# Altium project Project-C_LED.PrjPCB (part 1 of 2)
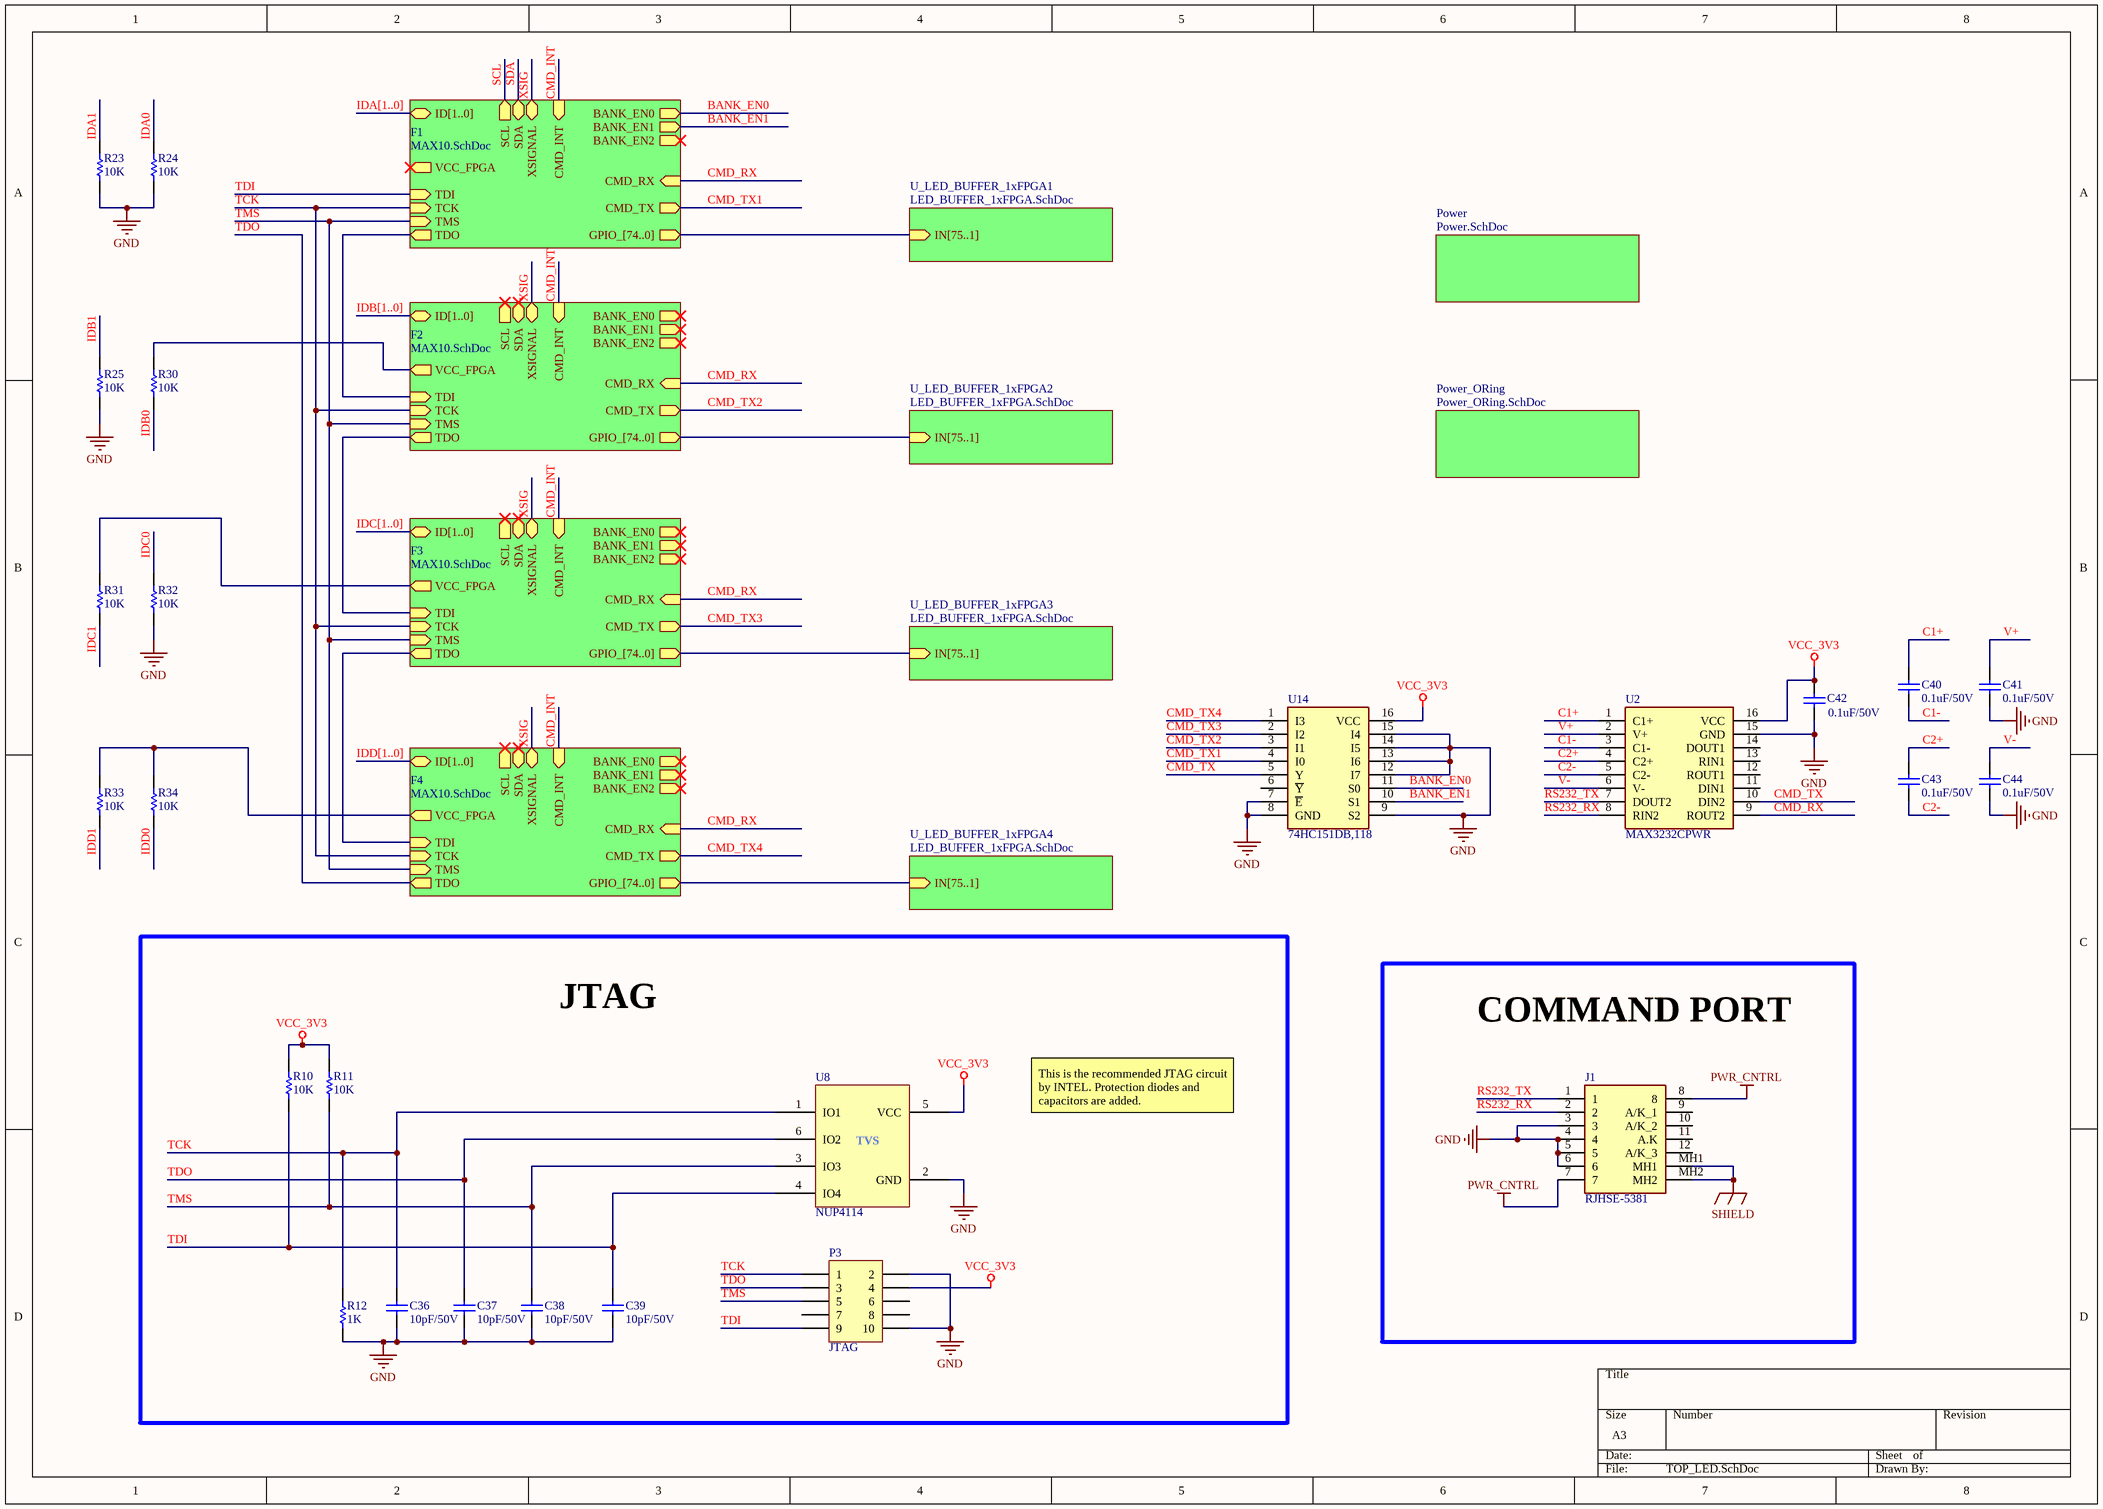
[diagram p0: TOP_LED.SchDoc]
8 sheets, 1590 parts. Net scope: hierarchical (ports join the sheet entries above them; power ports are global).
Board file: PCB5.PcbDoc
Sheets:
  TOP_LED.SchDoc
    F1 = MAX10.SchDoc
      IO = FPGA_IO.SchDoc
      POWER = FPGA_POWER.SchDoc
    Power = Power.SchDoc
    F2 = MAX10.SchDoc
      IO = FPGA_IO.SchDoc
      POWER = FPGA_POWER.SchDoc
    F3 = MAX10.SchDoc
      IO = FPGA_IO.SchDoc
      POWER = FPGA_POWER.SchDoc
    F4 = MAX10.SchDoc
      IO = FPGA_IO.SchDoc
      POWER = FPGA_POWER.SchDoc
    Power_ORing = Power_ORing.SchDoc
    U_LED_BUFFER_1xFPGA1 = LED_BUFFER_1xFPGA.SchDoc
      U_LED_BUFFER1 = LED_BUFFER.SchDoc
      U_LED_BUFFER2 = LED_BUFFER.SchDoc
      U_LED_BUFFER3 = LED_BUFFER.SchDoc
      U_LED_BUFFER4 = LED_BUFFER.SchDoc
      U_LED_BUFFER5 = LED_BUFFER.SchDoc
      U_LED_BUFFER6 = LED_BUFFER.SchDoc
      U_LED_BUFFER7 = LED_BUFFER.SchDoc
      U_LED_BUFFER8 = LED_BUFFER.SchDoc
      U_LED_BUFFER9 = LED_BUFFER.SchDoc
      U_LED_BUFFER10 = LED_BUFFER.SchDoc
    U_LED_BUFFER_1xFPGA2 = LED_BUFFER_1xFPGA.SchDoc
      U_LED_BUFFER1 = LED_BUFFER.SchDoc
      U_LED_BUFFER2 = LED_BUFFER.SchDoc
      U_LED_BUFFER3 = LED_BUFFER.SchDoc
      U_LED_BUFFER4 = LED_BUFFER.SchDoc
      U_LED_BUFFER5 = LED_BUFFER.SchDoc
      U_LED_BUFFER6 = LED_BUFFER.SchDoc
      U_LED_BUFFER7 = LED_BUFFER.SchDoc
      U_LED_BUFFER8 = LED_BUFFER.SchDoc
      U_LED_BUFFER9 = LED_BUFFER.SchDoc
      U_LED_BUFFER10 = LED_BUFFER.SchDoc
    U_LED_BUFFER_1xFPGA3 = LED_BUFFER_1xFPGA.SchDoc
      U_LED_BUFFER1 = LED_BUFFER.SchDoc
      U_LED_BUFFER2 = LED_BUFFER.SchDoc
      U_LED_BUFFER3 = LED_BUFFER.SchDoc
      U_LED_BUFFER4 = LED_BUFFER.SchDoc
      U_LED_BUFFER5 = LED_BUFFER.SchDoc
      U_LED_BUFFER6 = LED_BUFFER.SchDoc
      U_LED_BUFFER7 = LED_BUFFER.SchDoc
      U_LED_BUFFER8 = LED_BUFFER.SchDoc
      U_LED_BUFFER9 = LED_BUFFER.SchDoc
      U_LED_BUFFER10 = LED_BUFFER.SchDoc
    U_LED_BUFFER_1xFPGA4 = LED_BUFFER_1xFPGA.SchDoc
      U_LED_BUFFER1 = LED_BUFFER.SchDoc
      U_LED_BUFFER2 = LED_BUFFER.SchDoc
      U_LED_BUFFER3 = LED_BUFFER.SchDoc
      U_LED_BUFFER4 = LED_BUFFER.SchDoc
      U_LED_BUFFER5 = LED_BUFFER.SchDoc
      U_LED_BUFFER6 = LED_BUFFER.SchDoc
      U_LED_BUFFER7 = LED_BUFFER.SchDoc
      U_LED_BUFFER8 = LED_BUFFER.SchDoc
      U_LED_BUFFER9 = LED_BUFFER.SchDoc
      U_LED_BUFFER10 = LED_BUFFER.SchDoc

## Sheet TOP_LED.SchDoc
size A3

### Parts
C36  10pF/50V  [0603C]
C37  10pF/50V  [0603C]
C38  10pF/50V  [0603C]
C39  10pF/50V  [0603C]
C40  0.1uF/50V  [0603C]
C41  0.1uF/50V  [0603C]
C42  0.1uF/50V  [0603C]
C43  0.1uF/50V  [0603C]
C44  0.1uF/50V  [0603C]
J1  RJHSE-5381  [RJHSE5381]
P3  JTAG  [HDR2X5]  (no BOM)
R10  10K  [0603R]
R11  10K  [0603R]
R12  1K  [0603R]
R23  10K  [0603R]
R24  10K  [0603R]
R25  10K  [0603R]
R30  10K  [0603R]
R31  10K  [0603R]
R32  10K  [0603R]
R33  10K  [0603R]
R34  10K  [0603R]
U2  MAX3232CPWR  [MAX3232CPWR]
U8  NUP4114  [NUP4114HMR6T1G]
U14  74HC151DB,118  [74HC151DB,118]

### Blocks framed on the sheet
JTAG: C36-C39 P3 R10-R12 U8
COMMAND PORT: J1

### Sub-sheets
F1 = MAX10.SchDoc: TDI (in), TCK (in), TMS (in), TDO (out), CMD_RX (in), CMD_TX (out), SDA (bidir), CMD_INT (in), BANK_EN2 (out), GPIO_[74..0] (out), XSIGNAL (bidir), SCL (out), BANK_EN0 (out), BANK_EN1 (out), ID[1..0] (bidir), VCC_FPGA (out)
F2 = MAX10.SchDoc: TDI (in), TCK (in), TMS (in), TDO (out), CMD_RX (in), CMD_TX (out), SDA (bidir), CMD_INT (in), BANK_EN2 (out), GPIO_[74..0] (out), XSIGNAL (bidir), SCL (out), BANK_EN0 (out), BANK_EN1 (out), ID[1..0] (bidir), VCC_FPGA (out)
F3 = MAX10.SchDoc: TDI (in), TCK (in), TMS (in), TDO (out), CMD_RX (in), CMD_TX (out), SDA (bidir), CMD_INT (in), BANK_EN2 (out), GPIO_[74..0] (out), XSIGNAL (bidir), SCL (out), BANK_EN0 (out), BANK_EN1 (out), ID[1..0] (bidir), VCC_FPGA (out)
F4 = MAX10.SchDoc: TDI (in), TCK (in), TMS (in), TDO (out), CMD_RX (in), CMD_TX (out), SDA (bidir), CMD_INT (in), BANK_EN2 (out), GPIO_[74..0] (out), XSIGNAL (bidir), SCL (out), BANK_EN0 (out), BANK_EN1 (out), ID[1..0] (bidir), VCC_FPGA (out)
Power = Power.SchDoc: no entries
Power_ORing = Power_ORing.SchDoc: no entries
U_LED_BUFFER_1xFPGA1 = LED_BUFFER_1xFPGA.SchDoc: IN[75..1] (in)
U_LED_BUFFER_1xFPGA2 = LED_BUFFER_1xFPGA.SchDoc: IN[75..1] (in)
U_LED_BUFFER_1xFPGA3 = LED_BUFFER_1xFPGA.SchDoc: IN[75..1] (in)
U_LED_BUFFER_1xFPGA4 = LED_BUFFER_1xFPGA.SchDoc: IN[75..1] (in)

### Nets
GND: C36.1 C37.1 C38.1 C39.1 C41.1 C42.1 C44.1 J1.3 J1.4 J1.5 J1.6 P3.2 P3.10 R12.1 R23.2 R24.2 R25.2 R32.2 U2.15(GND) U8.2(GND) U14.7(~{E}) U14.8(GND) U14.9(S2) U14.12(I7) U14.13(I6) U14.14(I5) U14.15(I4)
PWR_CNTRL: J1.7 J1.8
SHIELD: J1.MH1 J1.MH2
VCC_3V3: C42.2 P3.4 R10.1 R11.1 U2.16(VCC) U8.5(VCC) U14.16(VCC)
BANK_EN0: U14.11(S0) ; sheet F1/BANK_EN0
BANK_EN1: U14.10(S1) ; sheet F1/BANK_EN1
C1+: C40.2 U2.1(C1+)
C1-: C40.1 U2.3(C1-)
C2+: C43.2 U2.4(C2+)
C2-: C43.1 U2.5(C2-)
CMD_INT: sheet F1/CMD_INT, sheet F2/CMD_INT, sheet F3/CMD_INT, sheet F4/CMD_INT
CMD_RX: U2.9(ROUT2) ; sheet F1/CMD_RX, sheet F2/CMD_RX, sheet F3/CMD_RX, sheet F4/CMD_RX
CMD_TX: U2.10(DIN2) U14.5(Y)
CMD_TX1: U14.4(I0) ; sheet F1/CMD_TX  [project net CMD_TX]
CMD_TX2: U14.3(I1) ; sheet F2/CMD_TX  [project net CMD_TX]
CMD_TX3: U14.2(I2) ; sheet F3/CMD_TX  [project net CMD_TX]
CMD_TX4: U14.1(I3) ; sheet F4/CMD_TX  [project net CMD_TX]
IDA0: R24.1  [project net ID0]
IDA1: R23.1  [project net ID1]
IDB0: R30.2  [project net ID0]
IDB1: R25.1  [project net ID1]
IDC0: R32.1  [project net ID0]
IDC1: R31.2  [project net ID1]
IDD0: R34.2  [project net ID0]
IDD1: R33.2  [project net ID1]
RS232_RX: J1.2 U2.8(RIN2)
RS232_TX: J1.1 U2.7(DOUT2)
TCK: C36.2 P3.1 R12.2 U8.1(IO1) ; sheet F1/TCK, sheet F2/TCK, sheet F3/TCK, sheet F4/TCK
TDI: C39.2 P3.9 R10.2 U8.4(IO4) ; sheet F1/TDI
TDI: sheet F1/TDO, sheet F2/TDI  [a separate net that carries the same name]
TDI: sheet F2/TDO, sheet F3/TDI  [a separate net that carries the same name]
TDI: sheet F3/TDO, sheet F4/TDI  [a separate net that carries the same name]
TDO: C37.2 P3.3 U8.6(IO2) ; sheet F4/TDO
TMS: C38.2 P3.5 R11.2 U8.3(IO3) ; sheet F1/TMS, sheet F2/TMS, sheet F3/TMS, sheet F4/TMS
V+: C41.2 U2.2(V+)
V-: C44.2 U2.6(V-)
VCC_FPGA: R30.1 ; sheet F2/VCC_FPGA
VCC_FPGA: R31.1 ; sheet F3/VCC_FPGA  [a separate net that carries the same name]
VCC_FPGA: R33.1 R34.1 ; sheet F4/VCC_FPGA  [a separate net that carries the same name]
XSIG: sheet F1/XSIGNAL, sheet F2/XSIGNAL, sheet F3/XSIGNAL, sheet F4/XSIGNAL

Not connected (* = marked no-connect by the designer): J1 9(A/K_1) 10(A/K_2) 11(A.K) 12(A/K_3); P3 6 7 8; U2 11(DIN1) 12(ROUT1) 13(RIN1) 14(DOUT1); U14 6(~{Y})

### Buses and harness runs
bus IDA[1..0] = sheet F1/ID[1..0]
bus IDB[1..0] = sheet F2/ID[1..0]
bus IDC[1..0] = sheet F3/ID[1..0]
bus IDD[1..0] = sheet F4/ID[1..0]
bus sheet F1/GPIO_[74..0] = sheet U_LED_BUFFER_1xFPGA1/IN[75..1]
bus sheet F2/GPIO_[74..0] = sheet U_LED_BUFFER_1xFPGA2/IN[75..1]
bus sheet F3/GPIO_[74..0] = sheet U_LED_BUFFER_1xFPGA3/IN[75..1]
bus sheet F4/GPIO_[74..0] = sheet U_LED_BUFFER_1xFPGA4/IN[75..1]

### Notes on the sheet
- This is the recommended JTAG circuit by INTEL. Protection diodes and capacitors are added.

### Library data of the parts
C36-C39 = Cap: Multilayer Ceramic Capacitors MLCC - SMD/SMT 50V 10pF 0603 C0G 5% AEC-Q200; Mfr: KEMET; Mfr Part No: C0603C100J5GACAUTO; Package: 0603; Price: 0.192; Stockiest: MOUSER; Stockiest Part No: 80-C0603C100J5GAUTO; Value: 10pF/50V
C40-C44 = Cap: Multilayer Ceramic Capacitors MLCC - SMD/SMT 50V 0.1uF 0603 X7R 20%; Mfr: KEMET; Mfr Part No: C0603C104M5RACTU; Package: 0603; Price: 0.101; Stockiest: MOUSER; Stockiest Part No: 80-C0603C104M5R; Value: 0.1uF/50V
J1 = RJHSE-5381: Modular Connectors / Ethernet Connectors R/A RJ45 SHEILDED 8 CONT Y/G LEDS; Mfr: Amphenol Commercial Products; Mfr Part No: RJHSE-5381; Price: 1.77; Stockiest: MOUSER; Stockiest Part No: 523-RJHSE-5381
P3 = Header 5X2: Header, 5-Pin, Dual row; Stockiest: MOUSER
R10 R11 R23-R25 R30-R34 = Res1: Thick Film Resistors - SMD 0603 10Kohms 1% Anti-Sulfur AEC-Q200; Mfr: ROHM Semiconductor; Mfr Part No: SFR03EZPF1002; Package: 0603; Price: 0.101; Stockiest: MOUSER; Stockiest Part No: 755-SFR03EZPF1002; Value: 10K
R12 = Res1: Resistor; Mfr: Vishay / Dale; Mfr Part No: CRCW06031K00FKEAC; Package: 0603; Price: 0.1; Stockiest: MOUSER; Stockiest Part No: 71-CRCW06031K00FKEAC; Value: 1K
U2 = MAX3232CPWR: RS-232 Interface IC 3-5.5V Mult-Ch RS232; Mfr: Texas Instruments; Mfr Part No: MAX3232CPWR; Price: 0.94; Stockiest: MOUSER; Stockiest Part No: 595-MAX3232CPWR
U8 = NUP4114: ESD Suppressors / TVS Diodes LOW CAP TVS ARRAY 5.5V; Mfr: ON SEMI; Mfr Part No: NUP4114HMR6T1G; Price: 0.534; Stockiest: MOUSER; Stockiest Part No: 863-NUP4114HMR6T1G; Value: TVS
U14 = 74HC151DB,118: Encoders, Decoders, Multiplexers & Demultiplexers 8-INPUT MULTIPLEXER; Mfr: NEXPERIA; Mfr Part No: 74HC151DB,118; Price: 0.887; Stockiest: MOUSER; Stockiest Part No: 771-HC151DB118

## Sheet MAX10.SchDoc
size B
Used 4 times, as channels F1, F2, F3, F4. Parts and nets are listed once, with the designators drawn on the sheet.
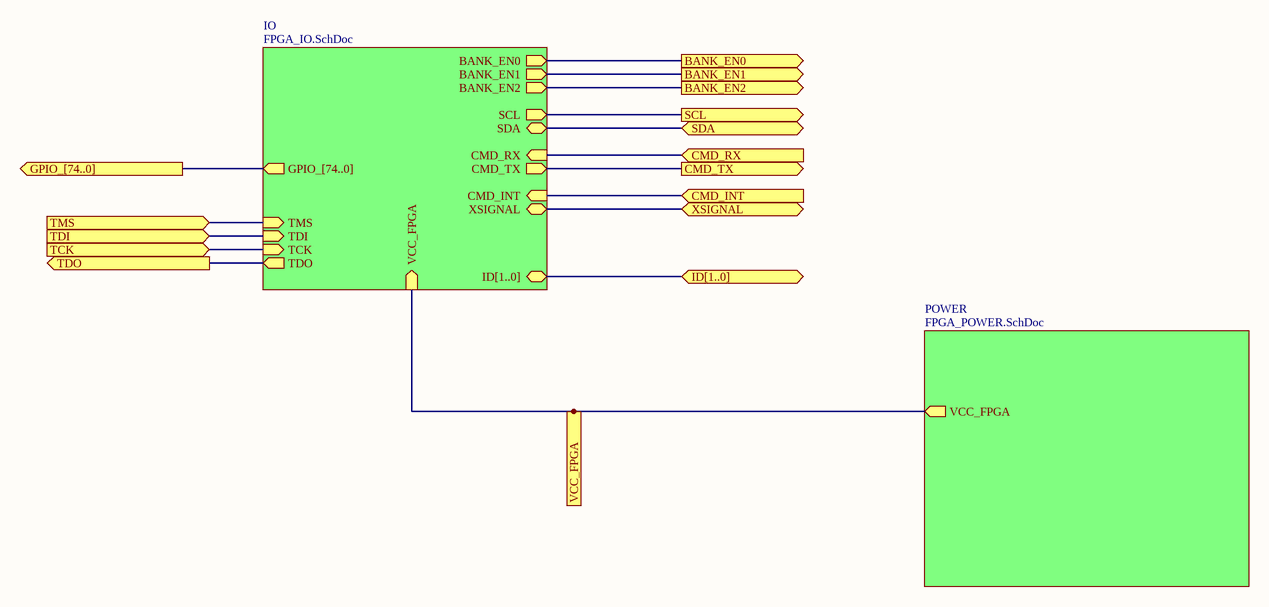
[diagram p1: MAX10.SchDoc]

### Sub-sheets
IO = FPGA_IO.SchDoc: CMD_RX (in), CMD_TX (out), BANK_EN1 (out), BANK_EN0 (out), SDA (bidir), CMD_INT (in), BANK_EN2 (out), SCL (out), GPIO_[74..0] (out), XSIGNAL (bidir), ID[1..0] (bidir), TMS (in), TDI (in), TCK (in), TDO (out), VCC_FPGA (in)
POWER = FPGA_POWER.SchDoc: VCC_FPGA (out)

### Ports
BANK_EN0 (out), BANK_EN1 (out), BANK_EN2 (out), CMD_INT (in), CMD_RX (in), CMD_TX (out), GPIO_[74..0] (out), ID[1..0] (bidir), SCL (out), SDA (bidir), TCK (in), TDI (in), TDO (out), TMS (in), VCC_FPGA (out), XSIGNAL (bidir)

### Nets
BANK_EN0: port BANK_EN0, sheet IO/BANK_EN0
BANK_EN1: port BANK_EN1, sheet IO/BANK_EN1
BANK_EN2: port BANK_EN2, sheet IO/BANK_EN2
CMD_INT: port CMD_INT, sheet IO/CMD_INT
CMD_RX: port CMD_RX, sheet IO/CMD_RX
CMD_TX: port CMD_TX, sheet IO/CMD_TX
SCL: port SCL, sheet IO/SCL
SDA: port SDA, sheet IO/SDA
TCK: port TCK, sheet IO/TCK
TDI: port TDI, sheet IO/TDI
TDO: port TDO, sheet IO/TDO
TMS: port TMS, sheet IO/TMS
VCC_FPGA: port VCC_FPGA, sheet IO/VCC_FPGA, sheet POWER/VCC_FPGA
XSIGNAL: port XSIGNAL, sheet IO/XSIGNAL

### Channels
F1: ports BANK_EN0=BANK_EN0 BANK_EN1=BANK_EN1 BANK_EN2=BANK_EN2_IO CMD_INT=CMD_INT CMD_RX=CMD_RX CMD_TX=CMD_TX SCL=SCL SDA=SDA TCK=TCK TDI=TDI TDO=TDI TMS=TMS VCC_FPGA=VCC_FPGA XSIGNAL=XSIG
F2: ports BANK_EN0=BANK_EN0_IO BANK_EN1=BANK_EN1_IO BANK_EN2=BANK_EN2_IO CMD_INT=CMD_INT CMD_RX=CMD_RX CMD_TX=CMD_TX SCL=SCL_IO SDA=SDA_IO TCK=TCK TDI=TDI TDO=TDI TMS=TMS VCC_FPGA=VCC_FPGA XSIGNAL=XSIG
F3: ports BANK_EN0=BANK_EN0_IO BANK_EN1=BANK_EN1_IO BANK_EN2=BANK_EN2_IO CMD_INT=CMD_INT CMD_RX=CMD_RX CMD_TX=CMD_TX SCL=SCL_IO SDA=SDA_IO TCK=TCK TDI=TDI TDO=TDI TMS=TMS VCC_FPGA=VCC_FPGA XSIGNAL=XSIG
F4: ports BANK_EN0=BANK_EN0_IO BANK_EN1=BANK_EN1_IO BANK_EN2=BANK_EN2_IO CMD_INT=CMD_INT CMD_RX=CMD_RX CMD_TX=CMD_TX SCL=SCL_IO SDA=SDA_IO TCK=TCK TDI=TDI TDO=TDO TMS=TMS VCC_FPGA=VCC_FPGA XSIGNAL=XSIG

### Buses and harness runs
bus port GPIO_[74..0] = sheet IO/GPIO_[74..0]
bus port ID[1..0] = sheet IO/ID[1..0]

## Sheet FPGA_IO.SchDoc
size B
Used 4 times, as channels F1/IO, F2/IO, F3/IO, F4/IO. Parts and nets are listed once, with the designators drawn on the sheet.
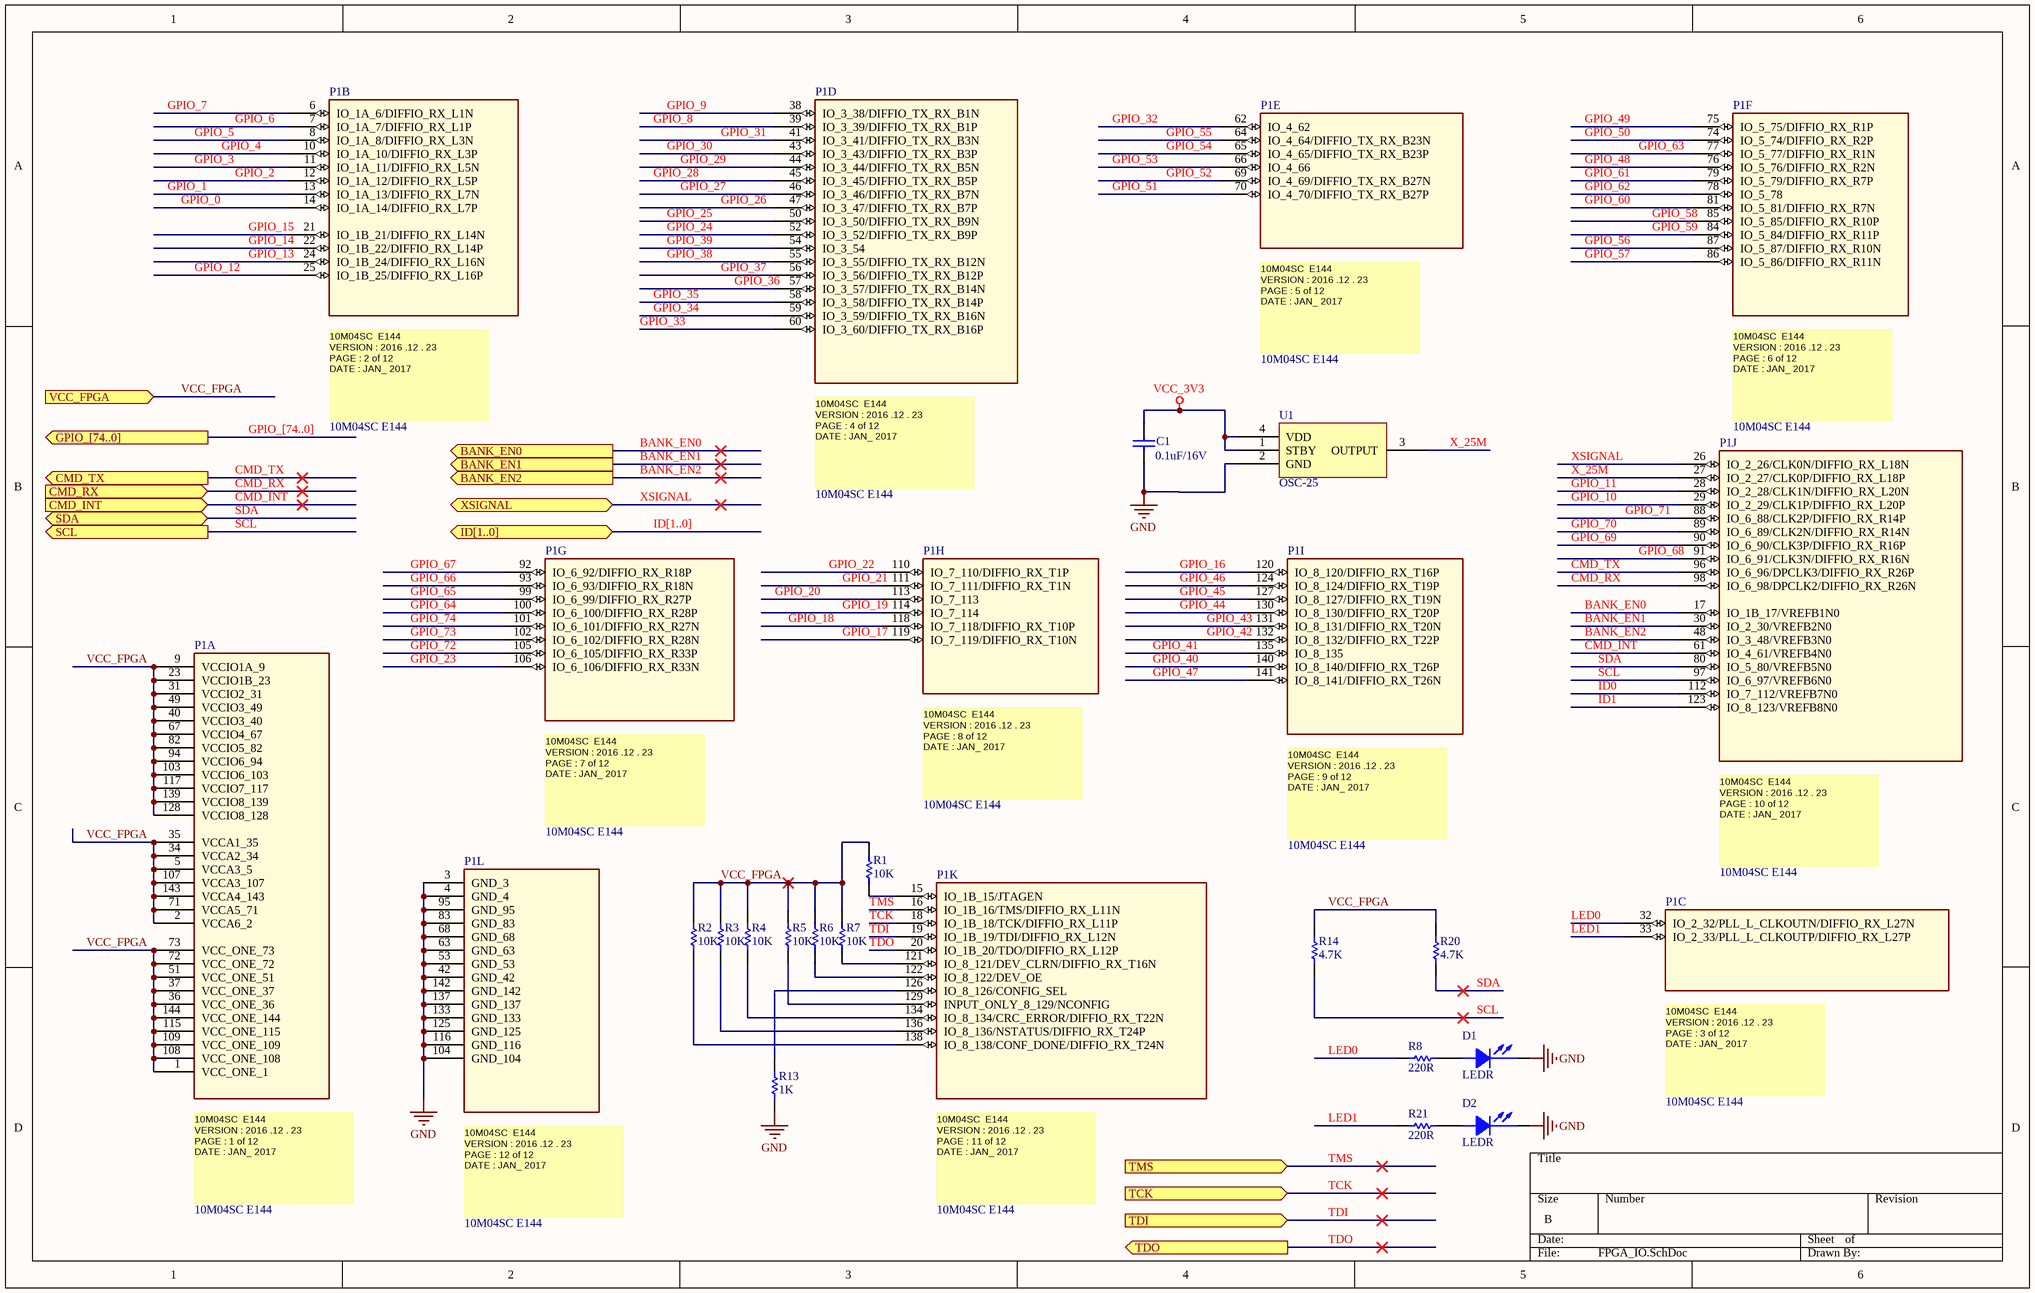
[diagram p2: FPGA_IO.SchDoc]

### Parts
C1  0.1uF/16V  [0603C]
D1  LEDR  [LED_0603]
D2  LEDR  [LED_0603]
P1  10M04SC E144  [10M04SCE144C8G]  (parts A,B,C,D,E,F,G,H,I,J,K,L of 12)
R1  10K  [0603R]
R2  10K  [0603R]
R3  10K  [0603R]
R4  10K  [0603R]
R5  10K  [0603R]
R6  10K  [0603R]
R7  10K  [0603R]
R8  220R  [0603R]
R13  1K  [0603R]
R14  4.7K  [0603R]
R20  4.7K  [0603R]
R21  220R  [0603R]
U1  OSC-25  [ASE-25.000MHZ-LC-T]

### Ports
BANK_EN0 (out), BANK_EN1 (out), BANK_EN2 (out), CMD_INT (in), CMD_RX (in), CMD_TX (out), GPIO_[74..0] (out), ID[1..0] (bidir), SCL (out), SDA (bidir), TCK (in), TDI (in), TDO (out), TMS (in), VCC_FPGA (in), XSIGNAL (bidir)

### Nets
GND: C1.1 D1.2(CATHODE) D2.2(CATHODE) P1.3(GND_3) P1.4(GND_4) P1.42(GND_42) P1.53(GND_53) P1.63(GND_63) P1.68(GND_68) P1.83(GND_83) P1.95(GND_95) P1.104(GND_104) P1.116(GND_116) P1.125(GND_125) P1.133(GND_133) P1.137(GND_137) P1.142(GND_142) R13.1 U1.2(GND)
VCC_3V3: C1.2 U1.1(STBY) U1.4(VDD)
BANK_EN0: P1.17(IO_1B_17/VREFB1N0) ; port BANK_EN0
BANK_EN1: P1.30(IO_2_30/VREFB2N0) ; port BANK_EN1
BANK_EN2: P1.48(IO_3_48/VREFB3N0) ; port BANK_EN2
CMD_INT: P1.61(IO_4_61/VREFB4N0) ; port CMD_INT
CMD_RX: P1.98(IO_6_98/DPCLK2/DIFFIO_RX_R26N) ; port CMD_RX
CMD_TX: P1.96(IO_6_96/DPCLK3/DIFFIO_RX_R26P) ; port CMD_TX
GPIO_0: P1.14(IO_1A_14/DIFFIO_RX_L7P)
GPIO_1: P1.13(IO_1A_13/DIFFIO_RX_L7N)
GPIO_2: P1.12(IO_1A_12/DIFFIO_RX_L5P)
GPIO_3: P1.11(IO_1A_11/DIFFIO_RX_L5N)
GPIO_4: P1.10(IO_1A_10/DIFFIO_RX_L3P)
GPIO_5: P1.8(IO_1A_8/DIFFIO_RX_L3N)
GPIO_6: P1.7(IO_1A_7/DIFFIO_RX_L1P)
GPIO_7: P1.6(IO_1A_6/DIFFIO_RX_L1N)
GPIO_8: P1.39(IO_3_39/DIFFIO_TX_RX_B1P)
GPIO_9: P1.38(IO_3_38/DIFFIO_TX_RX_B1N)
GPIO_10: P1.29(IO_2_29/CLK1P/DIFFIO_RX_L20P)
GPIO_11: P1.28(IO_2_28/CLK1N/DIFFIO_RX_L20N)
GPIO_12: P1.25(IO_1B_25/DIFFIO_RX_L16P)
GPIO_13: P1.24(IO_1B_24/DIFFIO_RX_L16N)
GPIO_14: P1.22(IO_1B_22/DIFFIO_RX_L14P)
GPIO_15: P1.21(IO_1B_21/DIFFIO_RX_L14N)
GPIO_16: P1.120(IO_8_120/DIFFIO_RX_T16P)
GPIO_17: P1.119(IO_7_119/DIFFIO_RX_T10N)
GPIO_18: P1.118(IO_7_118/DIFFIO_RX_T10P)
GPIO_19: P1.114(IO_7_114)
GPIO_20: P1.113(IO_7_113)
GPIO_21: P1.111(IO_7_111/DIFFIO_RX_T1N)
GPIO_22: P1.110(IO_7_110/DIFFIO_RX_T1P)
GPIO_23: P1.106(IO_6_106/DIFFIO_RX_R33N)
GPIO_24: P1.52(IO_3_52/DIFFIO_TX_RX_B9P)
GPIO_25: P1.50(IO_3_50/DIFFIO_TX_RX_B9N)
GPIO_26: P1.47(IO_3_47/DIFFIO_TX_RX_B7P)
GPIO_27: P1.46(IO_3_46/DIFFIO_TX_RX_B7N)
GPIO_28: P1.45(IO_3_45/DIFFIO_TX_RX_B5P)
GPIO_29: P1.44(IO_3_44/DIFFIO_TX_RX_B5N)
GPIO_30: P1.43(IO_3_43/DIFFIO_TX_RX_B3P)
GPIO_31: P1.41(IO_3_41/DIFFIO_TX_RX_B3N)
GPIO_32: P1.62(IO_4_62)
GPIO_33: P1.60(IO_3_60/DIFFIO_TX_RX_B16P)
GPIO_34: P1.59(IO_3_59/DIFFIO_TX_RX_B16N)
GPIO_35: P1.58(IO_3_58/DIFFIO_TX_RX_B14P)
GPIO_36: P1.57(IO_3_57/DIFFIO_TX_RX_B14N)
GPIO_37: P1.56(IO_3_56/DIFFIO_TX_RX_B12P)
GPIO_38: P1.55(IO_3_55/DIFFIO_TX_RX_B12N)
GPIO_39: P1.54(IO_3_54)
GPIO_40: P1.140(IO_8_140/DIFFIO_RX_T26P)
GPIO_41: P1.135(IO_8_135)
GPIO_42: P1.132(IO_8_132/DIFFIO_RX_T22P)
GPIO_43: P1.131(IO_8_131/DIFFIO_RX_T20N)
GPIO_44: P1.130(IO_8_130/DIFFIO_RX_T20P)
GPIO_45: P1.127(IO_8_127/DIFFIO_RX_T19N)
GPIO_46: P1.124(IO_8_124/DIFFIO_RX_T19P)
GPIO_47: P1.141(IO_8_141/DIFFIO_RX_T26N)
GPIO_48: P1.76(IO_5_76/DIFFIO_RX_R2N)
GPIO_49: P1.75(IO_5_75/DIFFIO_RX_R1P)
GPIO_50: P1.74(IO_5_74/DIFFIO_RX_R2P)
GPIO_51: P1.70(IO_4_70/DIFFIO_TX_RX_B27P)
GPIO_52: P1.69(IO_4_69/DIFFIO_TX_RX_B27N)
GPIO_53: P1.66(IO_4_66)
GPIO_54: P1.65(IO_4_65/DIFFIO_TX_RX_B23P)
GPIO_55: P1.64(IO_4_64/DIFFIO_TX_RX_B23N)
GPIO_56: P1.87(IO_5_87/DIFFIO_RX_R10N)
GPIO_57: P1.86(IO_5_86/DIFFIO_RX_R11N)
GPIO_58: P1.85(IO_5_85/DIFFIO_RX_R10P)
GPIO_59: P1.84(IO_5_84/DIFFIO_RX_R11P)
GPIO_60: P1.81(IO_5_81/DIFFIO_RX_R7N)
GPIO_61: P1.79(IO_5_79/DIFFIO_RX_R7P)
GPIO_62: P1.78(IO_5_78)
GPIO_63: P1.77(IO_5_77/DIFFIO_RX_R1N)
GPIO_64: P1.100(IO_6_100/DIFFIO_RX_R28P)
GPIO_65: P1.99(IO_6_99/DIFFIO_RX_R27P)
GPIO_66: P1.93(IO_6_93/DIFFIO_RX_R18N)
GPIO_67: P1.92(IO_6_92/DIFFIO_RX_R18P)
GPIO_68: P1.91(IO_6_91/CLK3N/DIFFIO_RX_R16N)
GPIO_69: P1.90(IO_6_90/CLK3P/DIFFIO_RX_R16P)
GPIO_70: P1.89(IO_6_89/CLK2N/DIFFIO_RX_R14N)
GPIO_71: P1.88(IO_6_88/CLK2P/DIFFIO_RX_R14P)
GPIO_72: P1.105(IO_6_105/DIFFIO_RX_R33P)
GPIO_73: P1.102(IO_6_102/DIFFIO_RX_R28N)
GPIO_74: P1.101(IO_6_101/DIFFIO_RX_R27N)
ID0: P1.112(IO_7_112/VREFB7N0)
ID1: P1.123(IO_8_123/VREFB8N0)
LED0: P1.32(IO_2_32/PLL_L_CLKOUTN/DIFFIO_RX_L27N) R8.2
LED1: P1.33(IO_2_33/PLL_L_CLKOUTP/DIFFIO_RX_L27P) R21.2
SCL: P1.97(IO_6_97/VREFB6N0) R14.1 ; port SCL
SDA: P1.80(IO_5_80/VREFB5N0) R20.1 ; port SDA
TCK: P1.18(IO_1B_18/TCK/DIFFIO_RX_L11P) ; port TCK
TDI: P1.19(IO_1B_19/TDI/DIFFIO_RX_L12N) ; port TDI
TDO: P1.20(IO_1B_20/TDO/DIFFIO_RX_L12P) ; port TDO
TMS: P1.16(IO_1B_16/TMS/DIFFIO_RX_L11N) ; port TMS
VCC_FPGA: P1.1(VCC_ONE_1) P1.2(VCCA6_2) P1.5(VCCA3_5) P1.9(VCCIO1A_9) P1.23(VCCIO1B_23) P1.31(VCCIO2_31) P1.34(VCCA2_34) P1.35(VCCA1_35) P1.36(VCC_ONE_36) P1.37(VCC_ONE_37) P1.40(VCCIO3_40) P1.49(VCCIO3_49) P1.51(VCC_ONE_51) P1.67(VCCIO4_67) P1.71(VCCA5_71) P1.72(VCC_ONE_72) P1.73(VCC_ONE_73) P1.82(VCCIO5_82) P1.94(VCCIO6_94) P1.103(VCCIO6_103) P1.107(VCCA3_107) P1.108(VCC_ONE_108) P1.109(VCC_ONE_109) P1.115(VCC_ONE_115) P1.117(VCCIO7_117) P1.128(VCCIO8_128) P1.139(VCCIO8_139) P1.143(VCCA4_143) P1.144(VCC_ONE_144) R1.1 R2.1 R3.1 R4.1 R5.1 R6.1 R7.1 R14.2 R20.2 ; port VCC_FPGA
X_25M: P1.27(IO_2_27/CLK0P/DIFFIO_RX_L18P) U1.3(OUTPUT)
XSIGNAL: P1.26(IO_2_26/CLK0N/DIFFIO_RX_L18N) ; port XSIGNAL
NetD1_1: D1.1(ANODE) R8.1
NetD2_1: D2.1(ANODE) R21.1
NetP1_15: P1.15(IO_1B_15/JTAGEN) R1.2
NetP1_121: P1.121(IO_8_121/DEV_CLRN/DIFFIO_RX_T16N) R7.2
NetP1_122: P1.122(IO_8_122/DEV_OE) R6.2
NetP1_126: P1.126(IO_8_126/CONFIG_SEL) R13.2
NetP1_129: P1.129(INPUT_ONLY_8_129/NCONFIG) R5.2
NetP1_134: P1.134(IO_8_134/CRC_ERROR/DIFFIO_RX_T22N) R4.2
NetP1_136: P1.136(IO_8_136/NSTATUS/DIFFIO_RX_T24P) R3.2
NetP1_138: P1.138(IO_8_138/CONF_DONE/DIFFIO_RX_T24N) R2.2

### Channels
F1/IO: designators end in _F1_IO; ports BANK_EN0=BANK_EN0 BANK_EN1=BANK_EN1 BANK_EN2=BANK_EN2_IO CMD_INT=CMD_INT CMD_RX=CMD_RX CMD_TX=CMD_TX SCL=SCL SDA=SDA TCK=TCK TDI=TDI TDO=TDI TMS=TMS VCC_FPGA=VCC_FPGA XSIGNAL=XSIG
F2/IO: designators end in _F2_IO; ports BANK_EN0=BANK_EN0_IO BANK_EN1=BANK_EN1_IO BANK_EN2=BANK_EN2_IO CMD_INT=CMD_INT CMD_RX=CMD_RX CMD_TX=CMD_TX SCL=SCL_IO SDA=SDA_IO TCK=TCK TDI=TDI TDO=TDI TMS=TMS VCC_FPGA=VCC_FPGA XSIGNAL=XSIG
F3/IO: designators end in _F3_IO; ports BANK_EN0=BANK_EN0_IO BANK_EN1=BANK_EN1_IO BANK_EN2=BANK_EN2_IO CMD_INT=CMD_INT CMD_RX=CMD_RX CMD_TX=CMD_TX SCL=SCL_IO SDA=SDA_IO TCK=TCK TDI=TDI TDO=TDI TMS=TMS VCC_FPGA=VCC_FPGA XSIGNAL=XSIG
F4/IO: designators end in _F4_IO; ports BANK_EN0=BANK_EN0_IO BANK_EN1=BANK_EN1_IO BANK_EN2=BANK_EN2_IO CMD_INT=CMD_INT CMD_RX=CMD_RX CMD_TX=CMD_TX SCL=SCL_IO SDA=SDA_IO TCK=TCK TDI=TDI TDO=TDO TMS=TMS VCC_FPGA=VCC_FPGA XSIGNAL=XSIG

### Buses and harness runs
bus GPIO_[74..0] = port GPIO_[74..0]
bus ID[1..0] = port ID[1..0]

### Notes on the sheet
- (in symbol 10M04SC E144, part A) 10M04SC  E144 / VERSION : 2016 .12 . 23 / PAGE : 1 of 12 / DATE : JAN_ 2017 /
- (in symbol 10M04SC E144, part B) 10M04SC  E144 / VERSION : 2016 .12 . 23 / PAGE : 2 of 12 / DATE : JAN_ 2017 /
- (in symbol 10M04SC E144, part C) 10M04SC  E144 / VERSION : 2016 .12 . 23 / PAGE : 3 of 12 / DATE : JAN_ 2017 /
- (in symbol 10M04SC E144, part D) 10M04SC  E144 / VERSION : 2016 .12 . 23 / PAGE : 4 of 12 / DATE : JAN_ 2017 /
- (in symbol 10M04SC E144, part E) 10M04SC  E144 / VERSION : 2016 .12 . 23 / PAGE : 5 of 12 / DATE : JAN_ 2017 /
- (in symbol 10M04SC E144, part F) 10M04SC  E144 / VERSION : 2016 .12 . 23 / PAGE : 6 of 12 / DATE : JAN_ 2017 /
- (in symbol 10M04SC E144, part G) 10M04SC  E144 / VERSION : 2016 .12 . 23 / PAGE : 7 of 12 / DATE : JAN_ 2017 /
- (in symbol 10M04SC E144, part H) 10M04SC  E144 / VERSION : 2016 .12 . 23 / PAGE : 8 of 12 / DATE : JAN_ 2017 /
- (in symbol 10M04SC E144, part I) 10M04SC  E144 / VERSION : 2016 .12 . 23 / PAGE : 9 of 12 / DATE : JAN_ 2017 /
- (in symbol 10M04SC E144, part J) 10M04SC  E144 / VERSION : 2016 .12 . 23 / PAGE : 10 of 12 / DATE : JAN_ 2017 /
- (in symbol 10M04SC E144, part K) 10M04SC  E144 / VERSION : 2016 .12 . 23 / PAGE : 11 of 12 / DATE : JAN_ 2017 /
- (in symbol 10M04SC E144, part L) 10M04SC  E144 / VERSION : 2016 .12 . 23 / PAGE : 12 of 12 / DATE : JAN_ 2017 /

### Library data of the parts
C1 = Cap: Multilayer Ceramic Capacitors MLCC - SMD/SMT 0603 16VDC 0.1uF 10% X7R AEC-Q200; Mfr: Taiyo Yuden; Mfr Part No: EMK107B7104KAHT; Package: 0603; Price: 0.101; Stockiest: MOUSER; Stockiest Part No: 963-EMK107B7104KAHT; Value: 0.1uF/16V
D1 D2 = LED: Standard LEDs - SMD Red 631nm 14mcd 5mA; Mfr: Lite-On; Mfr Part No: LTST-C193KRKT-5A; Package: 0603; Price: 0.393; Stockiest: MOUSER; Stockiest Part No: 859-LTSTC193KRKT5A; Value: RED
P1 = 10M04SC E144: FPGA - Field Programmable Gate Array non-volatile FPGA, 101 I/O, 144EQFP; Mfr: Intel / Altera; Mfr Part No: 10M04SCE144C8G; Package: EQFP144; Price: 11.52; Stockiest: MOUSER; Stockiest Part No: 989-10M04SCE144C8G
R1-R7 = Res1: as R10 on sheet TOP_LED; Package: 0603; Price: 0.101; Stockiest: MOUSER; Stockiest Part No: 755-SFR03EZPF1002; Value: 10K
R8 R21 = Res1: Thick Film Resistors - SMD 1/10Watt 220ohms 5% Commercial Use; Mfr: Vishay / Dale; Mfr Part No: CRCW0603220RJNEAC; Package: 0603; Price: 0.101; Stockiest: MOUSER; Stockiest Part No: 71-CRCW0603220RJNEAC; Value: 220R
R13 = Res1: as R12 on sheet TOP_LED; Package: 0603; Price: 0.1; Stockiest: MOUSER; Stockiest Part No: 71-CRCW06031K00FKEAC; Value: 1K
R14 R20 = Res1: Thick Film Resistors - SMD 1/10Watt 4.7Kohms 5% Commercial Use; Mfr: Vishay / Dale; Mfr Part No: CRCW06034K70JNEAC; Package: 0603; Price: 0.101; Stockiest: MOUSER; Stockiest Part No: 71-CRCW06034K70JNEAC; Value: 4.7K
U1 = CRYSTAL: Standard Clock Oscillators 25.0 MHZ 3.3V 50PPM SMD 32; Mfr: ABRACON; Value: 25MHZ; Mfr Part No: ASE-25.000MHZ-LC-T; Price: 1.42; Stockiest: MOUSER; Stockiest Part No: 815-ASE25.000MHZLCT

## Sheet FPGA_POWER.SchDoc
size B
Used 4 times, as channels F1/POWER, F2/POWER, F3/POWER, F4/POWER. Parts and nets are listed once, with the designators drawn on the sheet.
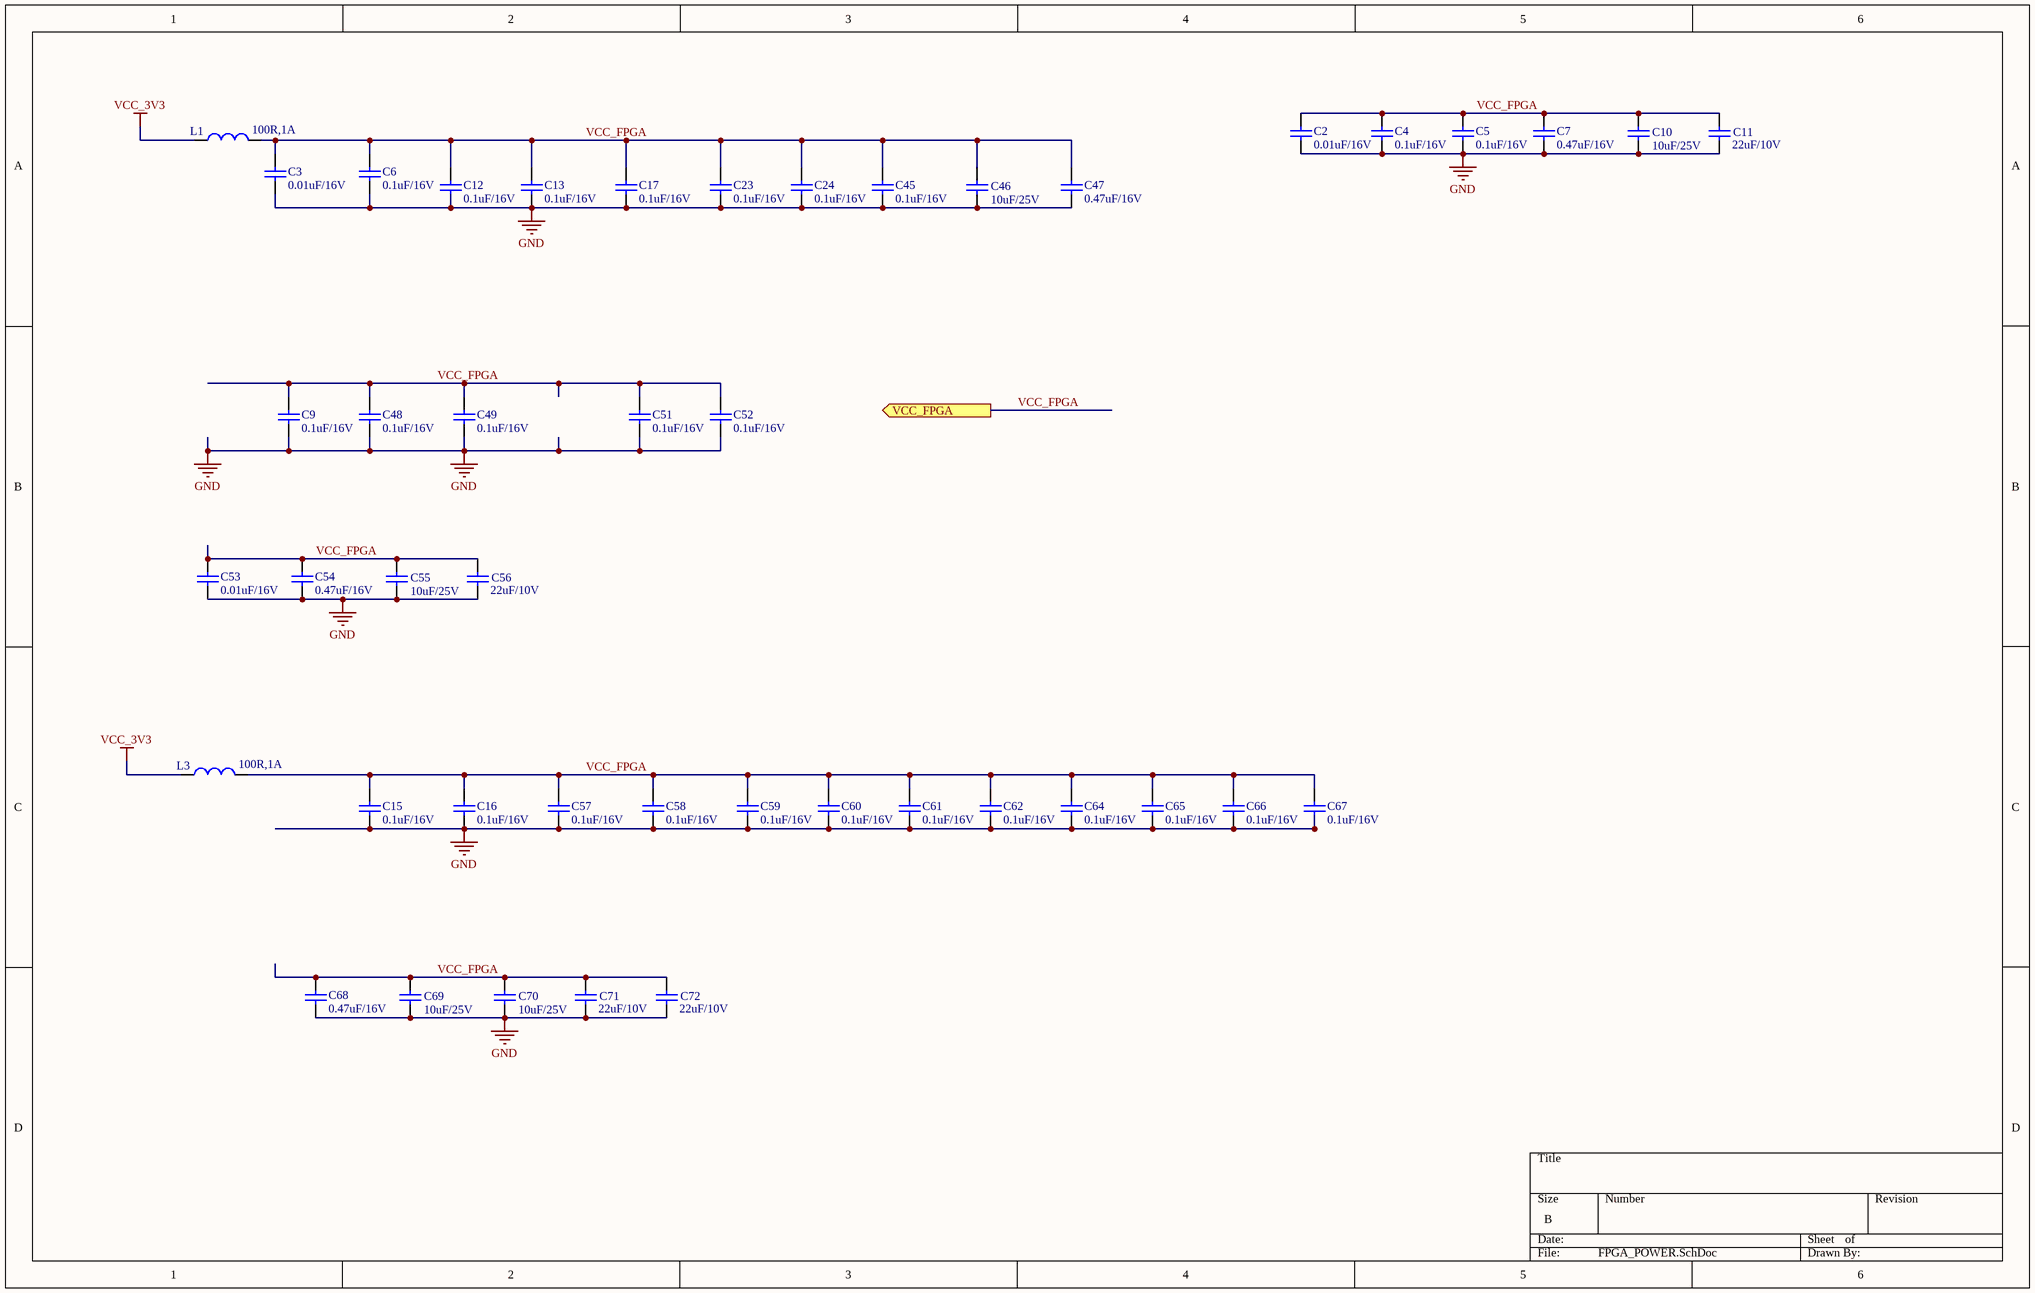
[diagram p3: FPGA_POWER.SchDoc]

### Parts
C2  0.01uF/16V  [0603C]
C3  0.01uF/16V  [0603C]
C4  0.1uF/16V  [0603C]
C5  0.1uF/16V  [0603C]
C6  0.1uF/16V  [0603C]
C7  0.47uF/16V  [0603C]
C9  0.1uF/16V  [0603C]
C10  10uF/25V  [0805C]
C11  22uF/10V  [0603C]
C12  0.1uF/16V  [0603C]
C13  0.1uF/16V  [0603C]
C15  0.1uF/16V  [0603C]
C16  0.1uF/16V  [0603C]
C17  0.1uF/16V  [0603C]
C23  0.1uF/16V  [0603C]
C24  0.1uF/16V  [0603C]
C45  0.1uF/16V  [0603C]
C46  10uF/25V  [0805C]
C47  0.47uF/16V  [0603C]
C48  0.1uF/16V  [0603C]
C49  0.1uF/16V  [0603C]
C51  0.1uF/16V  [0603C]
C52  0.1uF/16V  [0603C]
C53  0.01uF/16V  [0603C]
C54  0.47uF/16V  [0603C]
C55  10uF/25V  [0805C]
C56  22uF/10V  [0603C]
C57  0.1uF/16V  [0603C]
C58  0.1uF/16V  [0603C]
C59  0.1uF/16V  [0603C]
C60  0.1uF/16V  [0603C]
C61  0.1uF/16V  [0603C]
C62  0.1uF/16V  [0603C]
C64  0.1uF/16V  [0603C]
C65  0.1uF/16V  [0603C]
C66  0.1uF/16V  [0603C]
C67  0.1uF/16V  [0603C]
C68  0.47uF/16V  [0603C]
C69  10uF/25V  [0805C]
C70  10uF/25V  [0805C]
C71  22uF/10V  [0603C]
C72  22uF/10V  [0603C]
L1  100R,1A  [0603L]
L3  100R,1A  [0603L]

### Ports
VCC_FPGA (out)

### Nets
GND: C2.2 C3.2 C4.2 C5.2 C6.2 C7.2 C9.2 C10.1 C11.1 C12.2 C13.2 C15.2 C16.2 C17.2 C23.2 C24.2 C45.2 C46.1 C47.2 C48.2 C49.2 C51.2 C52.2 C53.2 C54.2 C55.1 C56.1 C57.2 C58.2 C59.2 C60.2 C61.2 C62.2 C64.2 C65.2 C66.2 C67.2 C68.2 C69.1 C70.1 C71.1 C72.1
VCC_3V3: L1.1 L3.1
VCC_FPGA: C2.1 C3.1 C4.1 C5.1 C6.1 C7.1 C9.1 C10.2 C11.2 C12.1 C13.1 C15.1 C16.1 C17.1 C23.1 C24.1 C45.1 C46.2 C47.1 C48.1 C49.1 C51.1 C52.1 C53.1 C54.1 C55.2 C56.2 C57.1 C58.1 C59.1 C60.1 C61.1 C62.1 C64.1 C65.1 C66.1 C67.1 C68.1 C69.2 C70.2 C71.2 C72.2 L1.2 L3.2 ; port VCC_FPGA

### Channels
F1/POWER: designators end in _F1_POWER; ports VCC_FPGA=VCC_FPGA
F2/POWER: designators end in _F2_POWER; ports VCC_FPGA=VCC_FPGA
F3/POWER: designators end in _F3_POWER; ports VCC_FPGA=VCC_FPGA
F4/POWER: designators end in _F4_POWER; ports VCC_FPGA=VCC_FPGA

### Library data of the parts
C2 C3 C53 = Cap: Multilayer Ceramic Capacitors MLCC - SMD/SMT 16V 0.01uF X7R 0603 10% AEC-Q200; Mfr: KEMET; Mfr Part No: C0603C103K4RECAUTO; Package: 0603; Price: 0.151; Stockiest: MOUSER; Stockiest Part No: 80-C0603C103K4RECAUT; Value: 0.01uF/16V
C4-C6 C9 C12 C13 C15-C17 C23 C24 C45 C48 C49 C51 C52 C57-C62 C64-C67 = Cap: as C1 on sheet FPGA_IO; Package: 0603; Price: 0.101; Stockiest: MOUSER; Stockiest Part No: 963-EMK107B7104KAHT; Value: 0.1uF/16V
C7 C47 C54 C68 = Cap: Multilayer Ceramic Capacitors MLCC - SMD/SMT 16V 0.47uF 0603 X7R 5% AEC-Q200; Mfr: KEMET; Mfr Part No: C0603C474J4RACAUTO; Package: 0603; Price: 0.444; Stockiest: MOUSER; Stockiest Part No: 80-C0603C474J4RAUTO; Value: 0.47uF/16V
C10 C46 C55 C69 C70 = Cap: Multilayer Ceramic Capacitors MLCC - SMD/SMT 0805 25VDC 10uF 20% X5R; Mfr: Taiyo Yuden; Mfr Part No: TMK212BBJ106MG-T; Package: 0805; Price: 0.232; Stockiest: MOUSER; Stockiest Part No: 963-TMK212BBJ106MG-T; Value: 10uF/25V
C11 C56 C71 C72 = Cap: Multilayer Ceramic Capacitors MLCC - SMD/SMT 1210 25VDC 22uF 20% X7R AEC-Q200; Mfr: TDK; Mfr Part No: C1608X5R1A226M080AC; Package: 0603; Price: 0.413; Stockiest: MOUSER; Stockiest Part No: 810-C1608X5R1A226M; Value: 22uF/10V
L1 L3 = 0805_IND: Ferrite Beads 100ohms 1A 60mOhms 0603 Ferrite Chip; Mfr: TDK; Mfr Part No: MPZ1608D101BTA00; Value: 100R/1A; Package: 0603; Price: 0.10; Stockiest: MOUSER; Stockiest Part No: 810-MPZ1608D101BTA00

## Sheet Power.SchDoc
size B
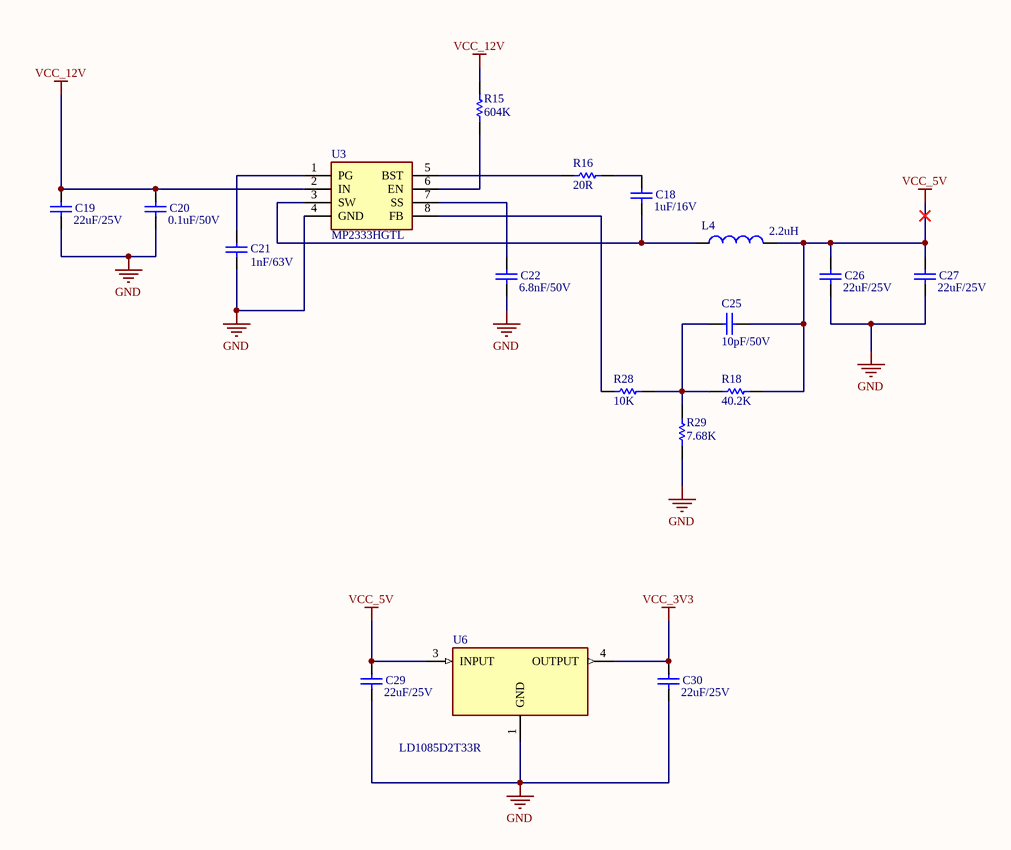
[diagram p4: Power.SchDoc]

### Parts
C18  1uF/16V  [0603C]
C19  22uF/25V  [1210C]
C20  0.1uF/50V  [0603C]
C21  1nF/63V  [0603C]
C22  6.8nF/50V  [0603C]
C25  10pF/50V  [0603C]
C26  22uF/25V  [1210C]
C27  22uF/25V  [1210C]
C29  22uF/25V  [1210C]
C30  22uF/25V  [1210C]
L4  2.2uH  [IHLP1616BZER2R2M5A]
R15  604K  [0603R]
R16  20R  [0603R]
R18  40.2K  [0603R]
R28  10K  [0603R]
R29  7.68K  [0603R]
U3  MP2333HGTL  [MP2333HGTL-P]
U6  LD1085D2T33R  [LD1085D2T33R]

### Nets
GND: C19.1 C20.1 C21.1 C22.1 C26.1 C27.1 C29.1 C30.1 R29.2 U3.4(GND) U6.1(GND)
VCC_3V3: C30.2 U6.4(OUTPUT)
VCC_5V: C25.1 C26.2 C27.2 C29.2 L4.2 R18.2 U6.3(INPUT)
VCC_12V: C19.2 C20.2 R15.2 U3.2(IN)
NetC18_1: C18.1 L4.1 U3.3(SW)
NetC18_2: C18.2 R16.2
NetC21_2: C21.2 U3.1(PG)
NetC22_2: C22.2 U3.7(SS)
NetC25_2: C25.2 R18.1 R28.1 R29.1
NetR15_1: R15.1 U3.6(EN)
NetR16_1: R16.1 U3.5(BST)
NetR28_2: R28.2 U3.8(FB)

### Library data of the parts
C18 = Cap: Multilayer Ceramic Capacitors MLCC - SMD/SMT 16volts 1uF X7R 10%; Mfr: KEMET; Mfr Part No: C0603C105K4RAC7411; Package: 0603; Price: 0.101; Stockiest: MOUSER; Stockiest Part No: 80-C0603C105K4RLR; Value: 1uF/16V
C19 C26 C27 C29 C30 = Cap: Multilayer Ceramic Capacitors MLCC - SMD/SMT 1210 25VDC 22uF 20% X7R AEC-Q200; Mfr: Taiyo Yuden; Mfr Part No: TMK325B7226MMHP; Package: 1210; Price: 0.807; Stockiest: MOUSER; Stockiest Part No: 963-TMK325B7226MMHP; Value: 22uF/25V
C20 = Cap: as C40 on sheet TOP_LED; Package: 0603; Price: 0.101; Stockiest: MOUSER; Stockiest Part No: 80-C0603C104M5R; Value: 0.1uF/50V
C21 = Cap: Multilayer Ceramic Capacitors MLCC - SMD/SMT 63V 1000pF 0603 X7R 10% AEC-Q200; Mfr: KEMET; Mfr Part No: 80-C0603C102KMREAUTO; Package: 0603; Price: 0.201; Stockiest: MOUSER; Stockiest Part No: C0603C102KMRECAUTO; Value: 1nF/63V
C22 = Cap: Multilayer Ceramic Capacitors MLCC - SMD/SMT 0603 50VDC 6.8nF 5% C0G AEC-Q200; Mfr: TDK; Mfr Part No: CGA3E2C0G1H682J080AE; Package: 0603; Price: 0.363; Stockiest: MOUSER; Stockiest Part No: 810-CGA3E2C0G1H682J8; Value: 6.8nF/50V
C25 = Cap: as C36 on sheet TOP_LED; Package: 0603; Price: 0.192; Stockiest: MOUSER; Stockiest Part No: 80-C0603C100J5GAUTO; Value: 10pF/50V
L4 = INDUCTOR: Fixed Inductors 2.2uH 20% High Temp AEC-Q200; Mfr: Vishay / Dale; Mfr Part No: IHLP1616BZER2R2M5A; Price: 1.36; Stockiest: MOUSER; Stockiest Part No: 70-IHLP1616BZR2R2M5A; Value: 2.2uH
R15 = Res1: Thick Film Resistors - SMD 0603 1% 604Kohm Anti-Sulfur AEC-Q200; Mfr: Panasonic; Mfr Part No: ERJ-U03F6043V; Package: 0603; Price: 0.221; Stockiest: MOUSER; Stockiest Part No: 667-ERJ-U03F6043V; Value: 604K
R16 = Res1: Thick Film Resistors - SMD 0603 0.25W 1% 20ohm AEC-Q200; Mfr: Panasonic; Mfr Part No: ERJ-UP3F20R0V; Package: 0603; Price: 0.262; Stockiest: MOUSER; Stockiest Part No: 667-ERJ-UP3F20R0V; Value: 20R
R18 = Res1: Thick Film Resistors - SMD 0603 Anti-Surge Res. 0.1%, 40.2Koh; Mfr: Panasonic; Mfr Part No: ERJ-PB3B4022V; Package: 0603; Price: 0.252; Stockiest: MOUSER; Stockiest Part No: 667-ERJ-PB3B4022V; Value: 40.2K
R28 = Res1: as R10 on sheet TOP_LED; Package: 0603; Price: 0.101; Stockiest: MOUSER; Stockiest Part No: 755-SFR03EZPF1002; Value: 10K
R29 = Res1: Thick Film Resistors - SMD 0603 Anti-Surge Res. 0.1%, 7.68Koh; Mfr: Panasonic; Mfr Part No: ERJ-PB3B7681V; Package: 0603; Price: 0.252; Stockiest: MOUSER; Stockiest Part No: 667-ERJ-PB3B7681V; Value: 7.68K
U3 = MP2333HGTL: Switching Voltage Regulators High-Efficiency, 3A, 18V, 1200kHz, Synchronous, Step-Down Converter; Mfr: Monolithic Power Systems (MPS); Value: 3.3V; Mfr Part No: MP2333HGTL-P; Price: 1.89; Stockiest: MOUSER; Stockiest Part No: 946-MP2333HGTL-P
U6 = LD1085D2T33R: Integrated Circuit; Mfr: STMicroelectronics; Value: 3.3V; Mfr Part No: LD1085D2T33R; Price: 1.30; Stockiest: MOUSER; Stockiest Part No: 511-LD1085D2T33-TR

## Sheet Power_ORing.SchDoc
size B
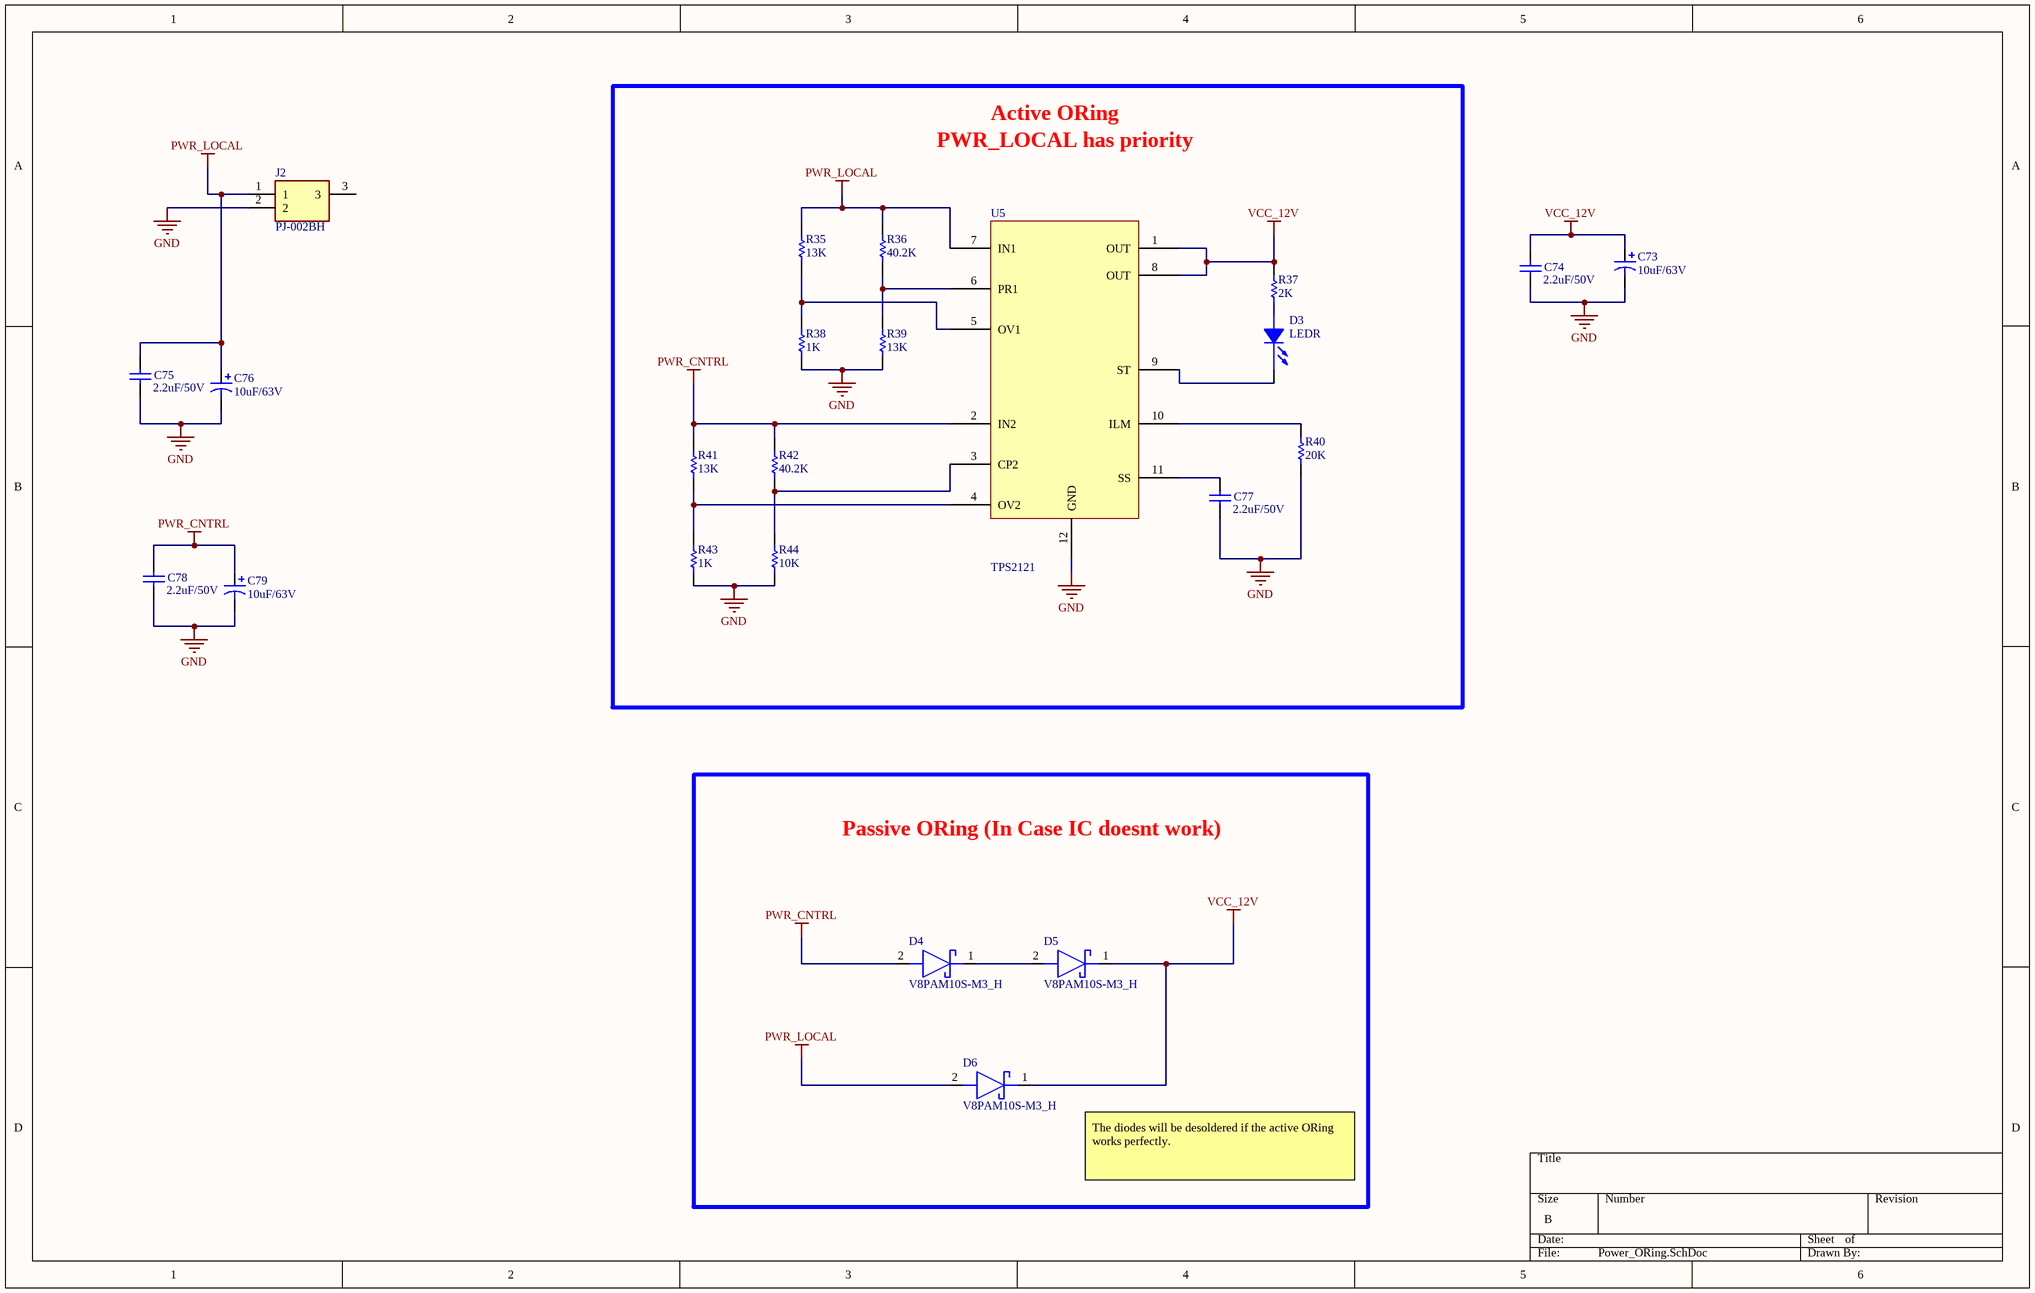
[diagram p5: Power_ORing.SchDoc]

### Parts
C73  10uF/63V  [EEE-FN1J100L]
C74  2.2uF/50V  [0603C]
C75  2.2uF/50V  [0603C]
C76  10uF/63V  [EEE-FN1J100L]
C77  2.2uF/50V  [0603C]
C78  2.2uF/50V  [0603C]
C79  10uF/63V  [EEE-FN1J100L]
D3  LEDR  [LED_0603]
D4  V8PAM10S-M3_H  [V8PAM10SHM3H]
D5  V8PAM10S-M3_H  [V8PAM10SHM3H]
D6  V8PAM10S-M3_H  [V8PAM10SHM3H]
J2  PJ-002BH  [PJ002BH]
R35  13K  [0603R]
R36  40.2K  [0603R]
R37  2K  [0603R]
R38  1K  [0603R]
R39  13K  [0603R]
R40  20K  [0603R]
R41  13K  [0603R]
R42  40.2K  [0603R]
R43  1K  [0603R]
R44  10K  [0603R]
U5  TPS2121  [TPS2121RUXT]

### Blocks framed on the sheet
Passive ORing (In Case IC doesnt work): D4-D6

### Nets
GND: C73.2 C74.1 C75.1 C76.2 C77.1 C78.1 C79.2 J2.2 R38.1 R39.2 R40.2 R43.1 R44.2 U5.12(GND)
PWR_CNTRL: C78.2 C79.1 D4.2(A) R41.1 R42.2 U5.2(IN2)
PWR_LOCAL: C75.2 C76.1 D6.2(A) J2.1 R35.1 R36.2 U5.7(IN1)
VCC_12V: C73.1 C74.2 D5.1(K) D6.1(K) R37.1 U5.1(OUT) U5.8(OUT)
NetC77_2: C77.2 U5.11(SS)
NetD3_1: D3.1(ANODE) R37.2
NetD3_2: D3.2(CATHODE) U5.9(ST)
NetD4_1: D4.1(K) D5.2(A)
NetR35_2: R35.2 R38.2 U5.5(OV1)
NetR36_1: R36.1 R39.1 U5.6(PR1)
NetR40_1: R40.1 U5.10(ILM)
NetR41_2: R41.2 R43.2 U5.4(OV2)
NetR42_1: R42.1 R44.1 U5.3(CP2)

Not connected (* = marked no-connect by the designer): J2 3

### Notes on the sheet
- PWR_LOCAL has priority
- Active ORing
- The diodes will be desoldered if the active ORing works perfectly.

### Library data of the parts
C73 C76 C79 = Cap Pol1: Polarized Capacitor (Radial); Mfr: Panasonic; Value: 10uF/63V; Mfr Part No: EEE-FN1J100L; Package: SMD; Stockiest: MOUSER; Price: 0.484; Stockiest Part No: 667-EEE-FN1J100L
C74 C75 C77 C78 = Cap: Multilayer Ceramic Capacitors MLCC - SMD/SMT 0603 2.2uF 20% 50VDC X5R; Mfr: Murata Electronics; Mfr Part No: GRM188R61H225ME11J; Package: 0603; Price: 0.333; Stockiest: MOUSER; Stockiest Part No: 81-GRM188R61H225ME1J; Value: 2.2uF/50V
D3 = LED: as D1 on sheet FPGA_IO; Package: 0603; Price: 0.393; Stockiest: MOUSER; Stockiest Part No: 859-LTSTC193KRKT5A; Value: RED
D4-D6 = V8PAM10S-M3_H: Schottky Diodes & Rectifiers 8A 100V; Mfr: Vishay General Semiconductor; Mfr Part No: V8PAM10S-M3/H; Price: 0.39; Stockiest: MOUSER; Stockiest Part No: 78-V8PAM10S-M3/H
J2 = PJ-002BH: DC Power Connectors Power Jacks; Mfr: CUI Devices; Mfr Part No: PJ-002BH; Price: 0.8; Stockiest: MOUSER; Stockiest Part No: 490-PJ-002BH
R35 R39 R41 = Res1: Thin Film Resistors - SMD 13K ohm 0.1% 25 ppm; Mfr: KOA Speer; Mfr Part No: RN73R1JTTD1302B25; Package: 0603; Price: 0.503; Stockiest: MOUSER; Stockiest Part No: 660-RN73R1JTD1302B25; Value: 13K
R36 R42 = Res1: as R18 on sheet Power; Package: 0603; Price: 0.252; Stockiest: MOUSER; Stockiest Part No: 667-ERJ-PB3B4022V; Value: 40.2K
R37 R44 = Res1: as R10 on sheet TOP_LED; Package: 0603; Price: 0.101; Stockiest: MOUSER; Stockiest Part No: 755-SFR03EZPF1002
  R37: Value: 2K
  R44: Value: 10K
R38 R43 = Res1: as R12 on sheet TOP_LED; Package: 0603; Price: 0.1; Stockiest: MOUSER; Stockiest Part No: 71-CRCW06031K00FKEAC; Value: 1K
R40 = Res1: Thick Film Resistors - SMD 20K OHM .1% 25PPM; Mfr: KOA Speer; Mfr Part No: RS73F1JTTD2002B; Package: 0603; Price: 0.61; Stockiest: MOUSER; Stockiest Part No: 660-RS73F1JTTD2002B; Value: 20K
U5 = TPS2121: Power Switch ICs - Power Distribution; Mfr: Texas Instruments; Mfr Part No: TPS2121RUXT; Price: 2.40; Stockiest: MOUSER; Stockiest Part No: 595-TPS2121RUXT

## Sheet LED_BUFFER_1xFPGA.SchDoc
size B
Used 4 times, as channels U_LED_BUFFER_1xFPGA1, U_LED_BUFFER_1xFPGA2, U_LED_BUFFER_1xFPGA3, U_LED_BUFFER_1xFPGA4. Parts and nets are listed once, with the designators drawn on the sheet.
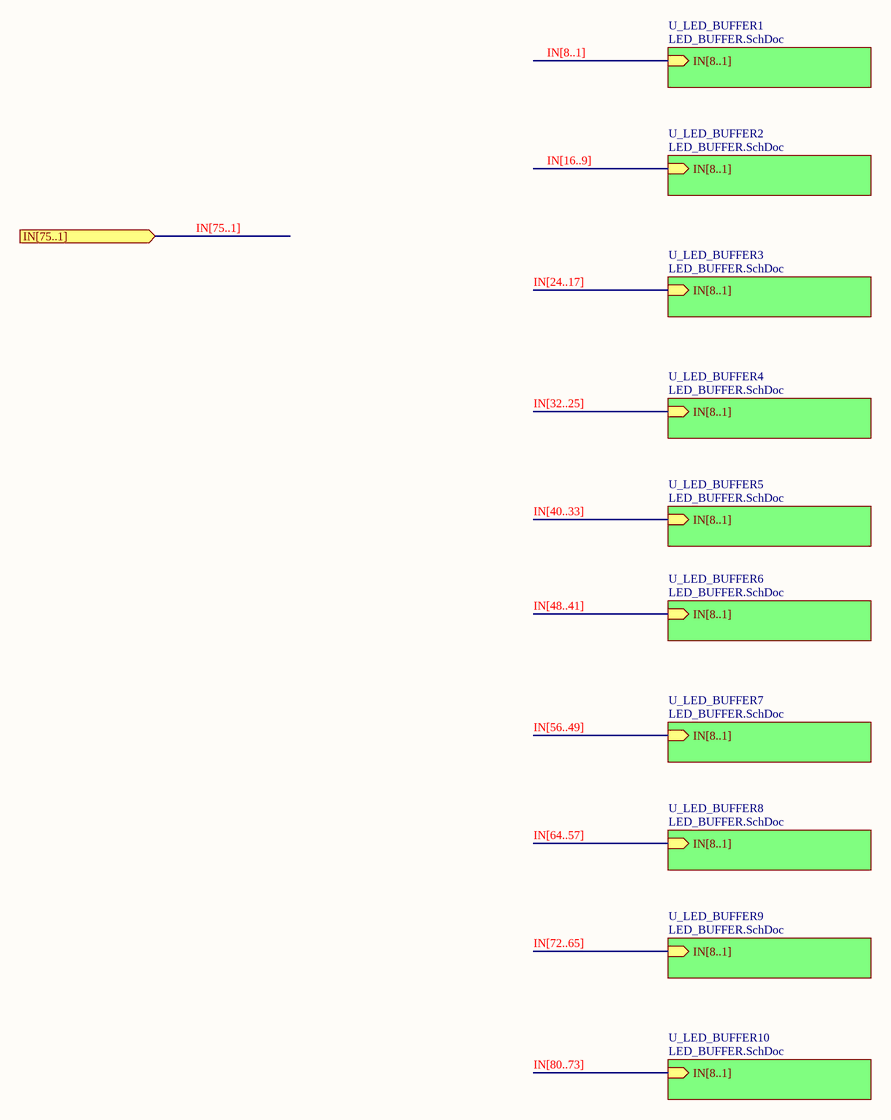
[diagram p6: LED_BUFFER_1xFPGA.SchDoc]

### Sub-sheets
U_LED_BUFFER1 = LED_BUFFER.SchDoc: IN[8..1] (in)
U_LED_BUFFER2 = LED_BUFFER.SchDoc: IN[8..1] (in)
U_LED_BUFFER3 = LED_BUFFER.SchDoc: IN[8..1] (in)
U_LED_BUFFER4 = LED_BUFFER.SchDoc: IN[8..1] (in)
U_LED_BUFFER5 = LED_BUFFER.SchDoc: IN[8..1] (in)
U_LED_BUFFER6 = LED_BUFFER.SchDoc: IN[8..1] (in)
U_LED_BUFFER7 = LED_BUFFER.SchDoc: IN[8..1] (in)
U_LED_BUFFER8 = LED_BUFFER.SchDoc: IN[8..1] (in)
U_LED_BUFFER9 = LED_BUFFER.SchDoc: IN[8..1] (in)
U_LED_BUFFER10 = LED_BUFFER.SchDoc: IN[8..1] (in)

### Ports
IN[75..1] (in)

### Channels
U_LED_BUFFER_1xFPGA1: no parts or ports
U_LED_BUFFER_1xFPGA2: no parts or ports
U_LED_BUFFER_1xFPGA3: no parts or ports
U_LED_BUFFER_1xFPGA4: no parts or ports

### Buses and harness runs
bus IN[8..1] = sheet U_LED_BUFFER1/IN[8..1]
bus IN[16..9] = sheet U_LED_BUFFER2/IN[8..1]
bus IN[24..17] = sheet U_LED_BUFFER3/IN[8..1]
bus IN[32..25] = sheet U_LED_BUFFER4/IN[8..1]
bus IN[40..33] = sheet U_LED_BUFFER5/IN[8..1]
bus IN[48..41] = sheet U_LED_BUFFER6/IN[8..1]
bus IN[56..49] = sheet U_LED_BUFFER7/IN[8..1]
bus IN[64..57] = sheet U_LED_BUFFER8/IN[8..1]
bus IN[72..65] = sheet U_LED_BUFFER9/IN[8..1]
bus IN[75..1] = port IN[75..1]
bus IN[80..73] = sheet U_LED_BUFFER10/IN[8..1]

## Sheet LED_BUFFER.SchDoc
size B
Used 40 times, as channels U_LED_BUFFER_1xFPGA1/U_LED_BUFFER1, U_LED_BUFFER_1xFPGA1/U_LED_BUFFER2, U_LED_BUFFER_1xFPGA1/U_LED_BUFFER3, U_LED_BUFFER_1xFPGA1/U_LED_BUFFER4, U_LED_BUFFER_1xFPGA1/U_LED_BUFFER5, U_LED_BUFFER_1xFPGA1/U_LED_BUFFER6, U_LED_BUFFER_1xFPGA1/U_LED_BUFFER7, U_LED_BUFFER_1xFPGA1/U_LED_BUFFER8, U_LED_BUFFER_1xFPGA1/U_LED_BUFFER9, U_LED_BUFFER_1xFPGA1/U_LED_BUFFER10, U_LED_BUFFER_1xFPGA2/U_LED_BUFFER1, U_LED_BUFFER_1xFPGA2/U_LED_BUFFER2, U_LED_BUFFER_1xFPGA2/U_LED_BUFFER3, U_LED_BUFFER_1xFPGA2/U_LED_BUFFER4, U_LED_BUFFER_1xFPGA2/U_LED_BUFFER5, U_LED_BUFFER_1xFPGA2/U_LED_BUFFER6, U_LED_BUFFER_1xFPGA2/U_LED_BUFFER7, U_LED_BUFFER_1xFPGA2/U_LED_BUFFER8, U_LED_BUFFER_1xFPGA2/U_LED_BUFFER9, U_LED_BUFFER_1xFPGA2/U_LED_BUFFER10, U_LED_BUFFER_1xFPGA3/U_LED_BUFFER1, U_LED_BUFFER_1xFPGA3/U_LED_BUFFER2, U_LED_BUFFER_1xFPGA3/U_LED_BUFFER3, U_LED_BUFFER_1xFPGA3/U_LED_BUFFER4, U_LED_BUFFER_1xFPGA3/U_LED_BUFFER5, U_LED_BUFFER_1xFPGA3/U_LED_BUFFER6, U_LED_BUFFER_1xFPGA3/U_LED_BUFFER7, U_LED_BUFFER_1xFPGA3/U_LED_BUFFER8, U_LED_BUFFER_1xFPGA3/U_LED_BUFFER9, U_LED_BUFFER_1xFPGA3/U_LED_BUFFER10, U_LED_BUFFER_1xFPGA4/U_LED_BUFFER1, U_LED_BUFFER_1xFPGA4/U_LED_BUFFER2, U_LED_BUFFER_1xFPGA4/U_LED_BUFFER3, U_LED_BUFFER_1xFPGA4/U_LED_BUFFER4, U_LED_BUFFER_1xFPGA4/U_LED_BUFFER5, U_LED_BUFFER_1xFPGA4/U_LED_BUFFER6, U_LED_BUFFER_1xFPGA4/U_LED_BUFFER7, U_LED_BUFFER_1xFPGA4/U_LED_BUFFER8, U_LED_BUFFER_1xFPGA4/U_LED_BUFFER9, U_LED_BUFFER_1xFPGA4/U_LED_BUFFER10. Parts and nets are listed once, with the designators drawn on the sheet.
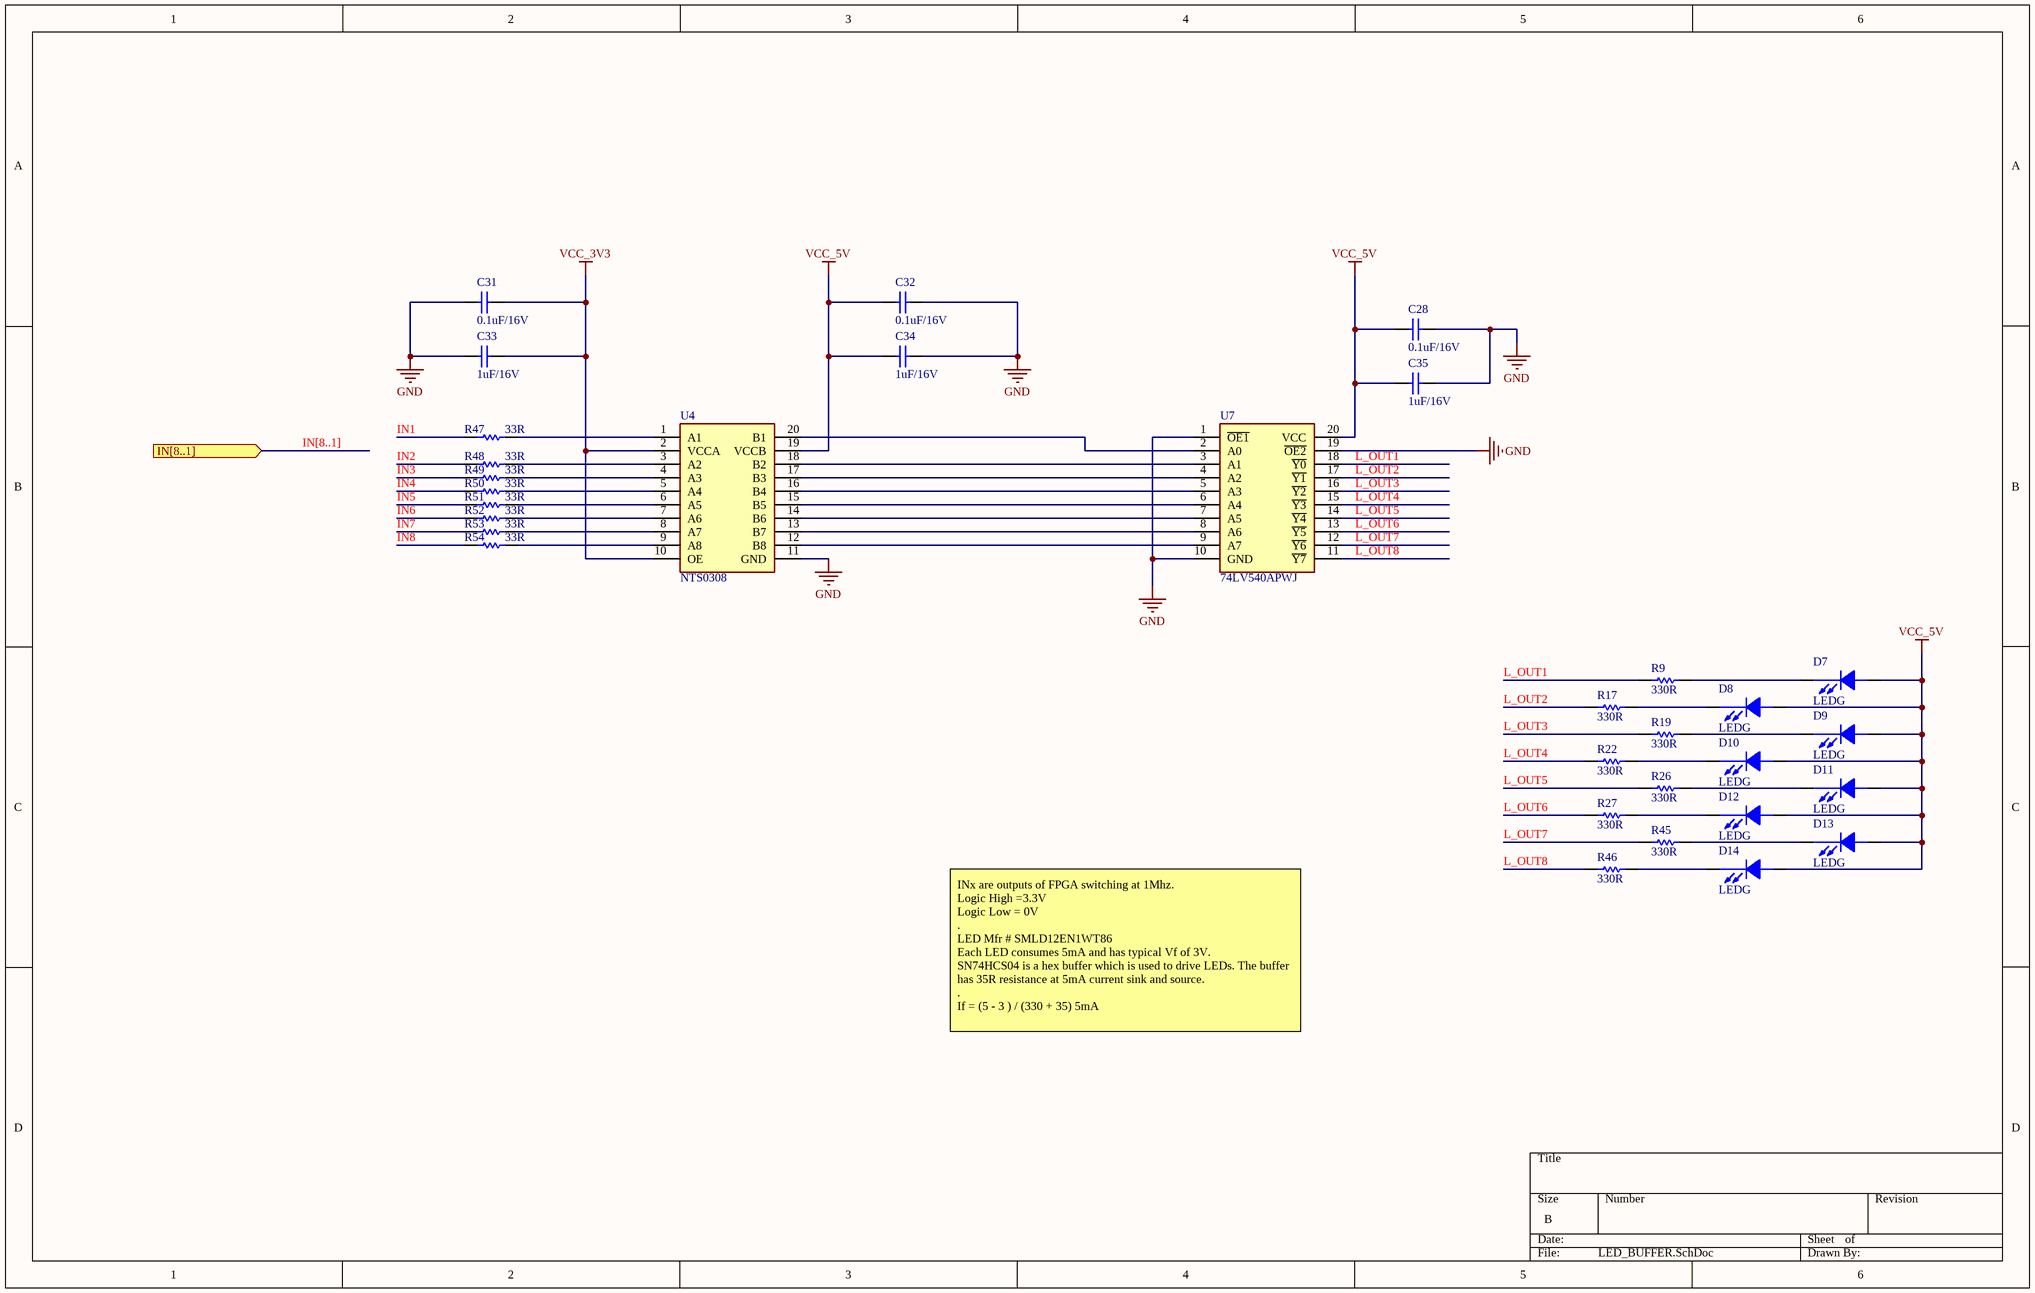
[diagram p7: LED_BUFFER.SchDoc]

### Parts
C28  0.1uF/16V  [0603C]
C31  0.1uF/16V  [0603C]
C32  0.1uF/16V  [0603C]
C33  1uF/16V  [0603C]
C34  1uF/16V  [0603C]
C35  1uF/16V  [0603C]
D7  LEDG  [LED_0603]
D8  LEDG  [LED_0603]
D9  LEDG  [LED_0603]
D10  LEDG  [LED_0603]
D11  LEDG  [LED_0603]
D12  LEDG  [LED_0603]
D13  LEDG  [LED_0603]
D14  LEDG  [LED_0603]
R9  330R  [0603R]
R17  330R  [0603R]
R19  330R  [0603R]
R22  330R  [0603R]
R26  330R  [0603R]
R27  330R  [0603R]
R45  330R  [0603R]
R46  330R  [0603R]
R47  33R  [0603R]
R48  33R  [0603R]
R49  33R  [0603R]
R50  33R  [0603R]
R51  33R  [0603R]
R52  33R  [0603R]
R53  33R  [0603R]
R54  33R  [0603R]
U4  NTS0308  [NTS0308EPWJ]
U7  74LV540APWJ  [SOP65P640X110-20N]

### Ports
IN[8..1] (in)

### Nets
GND: C28.2 C31.1 C32.2 C33.1 C34.2 C35.2 U4.11(GND) U7.1(~{OE1}) U7.10(GND) U7.19(~{OE2})
VCC_3V3: C31.2 C33.2 U4.2(VCCA) U4.10(OE)
VCC_5V: C28.1 C32.1 C34.1 C35.1 D7.1(ANODE) D8.1(ANODE) D9.1(ANODE) D10.1(ANODE) D11.1(ANODE) D12.1(ANODE) D13.1(ANODE) D14.1(ANODE) U4.19(VCCB) U7.20(VCC)
IN1: R47.2
IN2: R48.2
IN3: R49.2
IN4: R50.2
IN5: R51.2
IN6: R52.2
IN7: R53.2
IN8: R54.2
L_OUT1: R9.2 U7.18(~{Y0})
L_OUT2: R17.2 U7.17(~{Y1})
L_OUT3: R19.2 U7.16(~{Y2})
L_OUT4: R22.2 U7.15(~{Y3})
L_OUT5: R26.2 U7.14(~{Y4})
L_OUT6: R27.2 U7.13(~{Y5})
L_OUT7: R45.2 U7.12(~{Y6})
L_OUT8: R46.2 U7.11(~{Y7})
NetD7_2: D7.2(CATHODE) R9.1
NetD8_2: D8.2(CATHODE) R17.1
NetD9_2: D9.2(CATHODE) R19.1
NetD10_2: D10.2(CATHODE) R22.1
NetD11_2: D11.2(CATHODE) R26.1
NetD12_2: D12.2(CATHODE) R27.1
NetD13_2: D13.2(CATHODE) R45.1
NetD14_2: D14.2(CATHODE) R46.1
NetR47_1: R47.1 U4.1(A1)
NetR48_1: R48.1 U4.3(A2)
NetR49_1: R49.1 U4.4(A3)
NetR50_1: R50.1 U4.5(A4)
NetR51_1: R51.1 U4.6(A5)
NetR52_1: R52.1 U4.7(A6)
NetR53_1: R53.1 U4.8(A7)
NetR54_1: R54.1 U4.9(A8)
NetU4_12: U4.12(B8) U7.9(A7)
NetU4_13: U4.13(B7) U7.8(A6)
NetU4_14: U4.14(B6) U7.7(A5)
NetU4_15: U4.15(B5) U7.6(A4)
NetU4_16: U4.16(B4) U7.5(A3)
NetU4_17: U4.17(B3) U7.4(A2)
NetU4_18: U4.18(B2) U7.3(A1)
NetU4_20: U4.20(B1) U7.2(A0)

### Channels
U_LED_BUFFER_1xFPGA1/U_LED_BUFFER1: designators end in _U_LED_BUFFER_1xFPGA1_U_LED_BUFFER1
U_LED_BUFFER_1xFPGA1/U_LED_BUFFER2: designators end in _U_LED_BUFFER_1xFPGA1_U_LED_BUFFER2
U_LED_BUFFER_1xFPGA1/U_LED_BUFFER3: designators end in _U_LED_BUFFER_1xFPGA1_U_LED_BUFFER3
U_LED_BUFFER_1xFPGA1/U_LED_BUFFER4: designators end in _U_LED_BUFFER_1xFPGA1_U_LED_BUFFER4
U_LED_BUFFER_1xFPGA1/U_LED_BUFFER5: designators end in _U_LED_BUFFER_1xFPGA1_U_LED_BUFFER5
U_LED_BUFFER_1xFPGA1/U_LED_BUFFER6: designators end in _U_LED_BUFFER_1xFPGA1_U_LED_BUFFER6
U_LED_BUFFER_1xFPGA1/U_LED_BUFFER7: designators end in _U_LED_BUFFER_1xFPGA1_U_LED_BUFFER7
U_LED_BUFFER_1xFPGA1/U_LED_BUFFER8: designators end in _U_LED_BUFFER_1xFPGA1_U_LED_BUFFER8
U_LED_BUFFER_1xFPGA1/U_LED_BUFFER9: designators end in _U_LED_BUFFER_1xFPGA1_U_LED_BUFFER9
U_LED_BUFFER_1xFPGA1/U_LED_BUFFER10: designators end in _U_LED_BUFFER_1xFPGA1_U_LED_BUFFER10
U_LED_BUFFER_1xFPGA2/U_LED_BUFFER1: designators end in _U_LED_BUFFER_1xFPGA2_U_LED_BUFFER1
U_LED_BUFFER_1xFPGA2/U_LED_BUFFER2: designators end in _U_LED_BUFFER_1xFPGA2_U_LED_BUFFER2
U_LED_BUFFER_1xFPGA2/U_LED_BUFFER3: designators end in _U_LED_BUFFER_1xFPGA2_U_LED_BUFFER3
U_LED_BUFFER_1xFPGA2/U_LED_BUFFER4: designators end in _U_LED_BUFFER_1xFPGA2_U_LED_BUFFER4
U_LED_BUFFER_1xFPGA2/U_LED_BUFFER5: designators end in _U_LED_BUFFER_1xFPGA2_U_LED_BUFFER5
U_LED_BUFFER_1xFPGA2/U_LED_BUFFER6: designators end in _U_LED_BUFFER_1xFPGA2_U_LED_BUFFER6
U_LED_BUFFER_1xFPGA2/U_LED_BUFFER7: designators end in _U_LED_BUFFER_1xFPGA2_U_LED_BUFFER7
U_LED_BUFFER_1xFPGA2/U_LED_BUFFER8: designators end in _U_LED_BUFFER_1xFPGA2_U_LED_BUFFER8
U_LED_BUFFER_1xFPGA2/U_LED_BUFFER9: designators end in _U_LED_BUFFER_1xFPGA2_U_LED_BUFFER9
U_LED_BUFFER_1xFPGA2/U_LED_BUFFER10: designators end in _U_LED_BUFFER_1xFPGA2_U_LED_BUFFER10
U_LED_BUFFER_1xFPGA3/U_LED_BUFFER1: designators end in _U_LED_BUFFER_1xFPGA3_U_LED_BUFFER1
U_LED_BUFFER_1xFPGA3/U_LED_BUFFER2: designators end in _U_LED_BUFFER_1xFPGA3_U_LED_BUFFER2
U_LED_BUFFER_1xFPGA3/U_LED_BUFFER3: designators end in _U_LED_BUFFER_1xFPGA3_U_LED_BUFFER3
U_LED_BUFFER_1xFPGA3/U_LED_BUFFER4: designators end in _U_LED_BUFFER_1xFPGA3_U_LED_BUFFER4
U_LED_BUFFER_1xFPGA3/U_LED_BUFFER5: designators end in _U_LED_BUFFER_1xFPGA3_U_LED_BUFFER5
U_LED_BUFFER_1xFPGA3/U_LED_BUFFER6: designators end in _U_LED_BUFFER_1xFPGA3_U_LED_BUFFER6
U_LED_BUFFER_1xFPGA3/U_LED_BUFFER7: designators end in _U_LED_BUFFER_1xFPGA3_U_LED_BUFFER7
U_LED_BUFFER_1xFPGA3/U_LED_BUFFER8: designators end in _U_LED_BUFFER_1xFPGA3_U_LED_BUFFER8
U_LED_BUFFER_1xFPGA3/U_LED_BUFFER9: designators end in _U_LED_BUFFER_1xFPGA3_U_LED_BUFFER9
U_LED_BUFFER_1xFPGA3/U_LED_BUFFER10: designators end in _U_LED_BUFFER_1xFPGA3_U_LED_BUFFER10
U_LED_BUFFER_1xFPGA4/U_LED_BUFFER1: designators end in _U_LED_BUFFER_1xFPGA4_U_LED_BUFFER1
U_LED_BUFFER_1xFPGA4/U_LED_BUFFER2: designators end in _U_LED_BUFFER_1xFPGA4_U_LED_BUFFER2
U_LED_BUFFER_1xFPGA4/U_LED_BUFFER3: designators end in _U_LED_BUFFER_1xFPGA4_U_LED_BUFFER3
U_LED_BUFFER_1xFPGA4/U_LED_BUFFER4: designators end in _U_LED_BUFFER_1xFPGA4_U_LED_BUFFER4
U_LED_BUFFER_1xFPGA4/U_LED_BUFFER5: designators end in _U_LED_BUFFER_1xFPGA4_U_LED_BUFFER5
U_LED_BUFFER_1xFPGA4/U_LED_BUFFER6: designators end in _U_LED_BUFFER_1xFPGA4_U_LED_BUFFER6
U_LED_BUFFER_1xFPGA4/U_LED_BUFFER7: designators end in _U_LED_BUFFER_1xFPGA4_U_LED_BUFFER7
U_LED_BUFFER_1xFPGA4/U_LED_BUFFER8: designators end in _U_LED_BUFFER_1xFPGA4_U_LED_BUFFER8
U_LED_BUFFER_1xFPGA4/U_LED_BUFFER9: designators end in _U_LED_BUFFER_1xFPGA4_U_LED_BUFFER9
U_LED_BUFFER_1xFPGA4/U_LED_BUFFER10: designators end in _U_LED_BUFFER_1xFPGA4_U_LED_BUFFER10

### Buses and harness runs
bus IN[8..1] = port IN[8..1]

### Notes on the sheet
- INx are outputs of FPGA switching at 1Mhz.
  Logic High =3.3V
  Logic Low = 0V
  .
  LED Mfr # SMLD12EN1WT86
  Each LED consumes 5mA and has typical Vf of 3V.
  SN74HCS04 is a hex buffer which is used to drive LEDs. The buffer has 35R resistance at 5mA current sink and source.
  .
  If = (5 - 3 ) / (330 + 35) 5mA

### Library data of the parts
C28 C31 C32 = Cap: as C1 on sheet FPGA_IO; Package: 0603; Price: 0.101; Stockiest: MOUSER; Stockiest Part No: 963-EMK107B7104KAHT; Value: 0.1uF/16V
C33-C35 = Cap: Multilayer Ceramic Capacitors MLCC - SMD/SMT 16volts 1uF X7R 10%; Mfr: KEMET; Mfr Part No: C0603C105K4RACTU; Package: 0603; Price: 0.101; Stockiest: MOUSER; Stockiest Part No: 80-C0603C105K4R; Value: 1uF/16V
D7-D14 = LED: Standard LEDs - SMD Grn 527nm; 140mcd 0603; 70mW; Mfr: ROHM Semiconductor; Mfr Part No: SMLD12EN1WT86; Value: GREEN; Package: 0603; Price: 0.695; Stockiest: MOUSER; Stockiest Part No: 755-SMLD12EN1WT86
R9 R17 R19 R22 R26 R27 R45 R46 = Res1: Thick Film Resistors - SMD 1/10Watt 330ohms 1% Commercial Use; Mfr: Vishay / Dale; Mfr Part No: CRCW0603330RFKEAC; Package: 0603; Price: 0.101; Stockiest: MOUSER; Stockiest Part No: 71-CRCW0603330RFKEAC; Value: 330R
R47-R54 = Res1: Thick Film Resistors - SMD 1/10Watt 33ohms 1% Commercial Use; Mfr: Vishay / Dale; Mfr Part No: CRCW060333R0FKEAC; Package: 0603; Price: 0.101; Stockiest: MOUSER; Stockiest Part No: 71-CRCW060333R0FKEAC; Value: 33R
U4 = TXS0108EPWR: Translation - Voltage Levels Dual supply translating transceiver; open drain; auto direction sensing; Mfr: NXP Semiconductors; Value: 8-BIT; Mfr Part No: NTS0308EPWJ; Price: 1.43; Stockiest: MOUSER; Stockiest Part No: 771-NTS0308EPWJ
U7 = 74LV540APWJ: Buffers & Line Drivers BUFFER LINE DRIVER; Mfr: Nexperia; Value: 16mA; Mfr Part No: 74LV540APWJ; Package: TSSOP-20; Price: 0.645; Stockiest: MOUSER; Stockiest Part No: 771-74LV540APWJ